# EAGLE design timer rtc io (EAGLE 9.6.2)
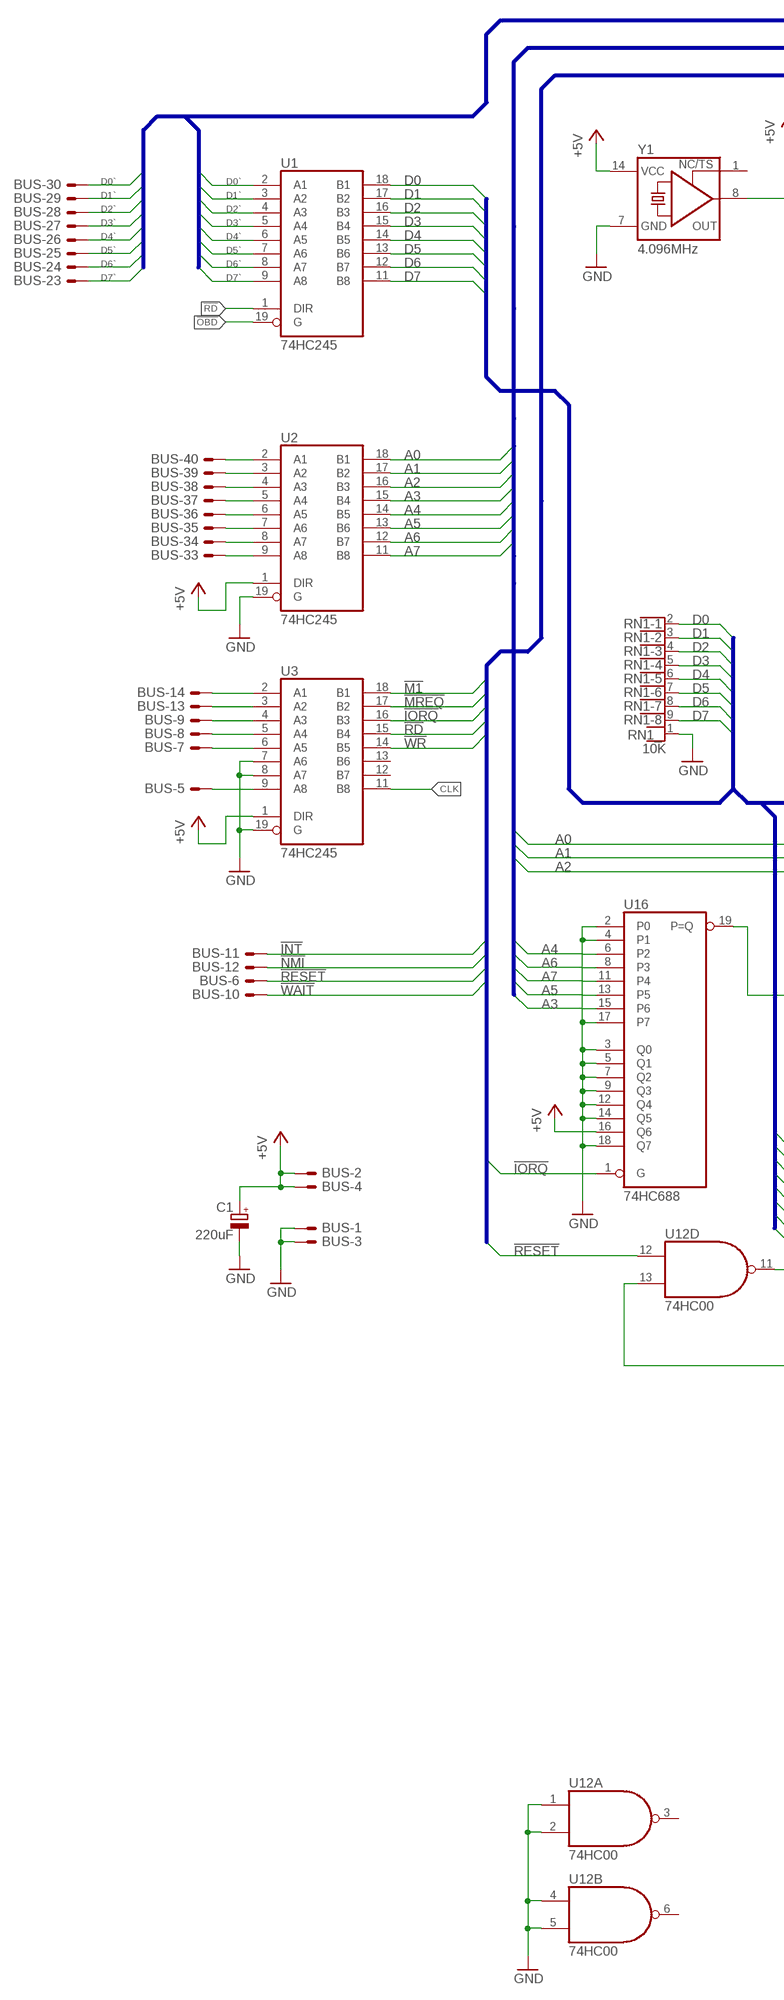
[diagram p0: schematic, sheet 1, part 1 of 2]
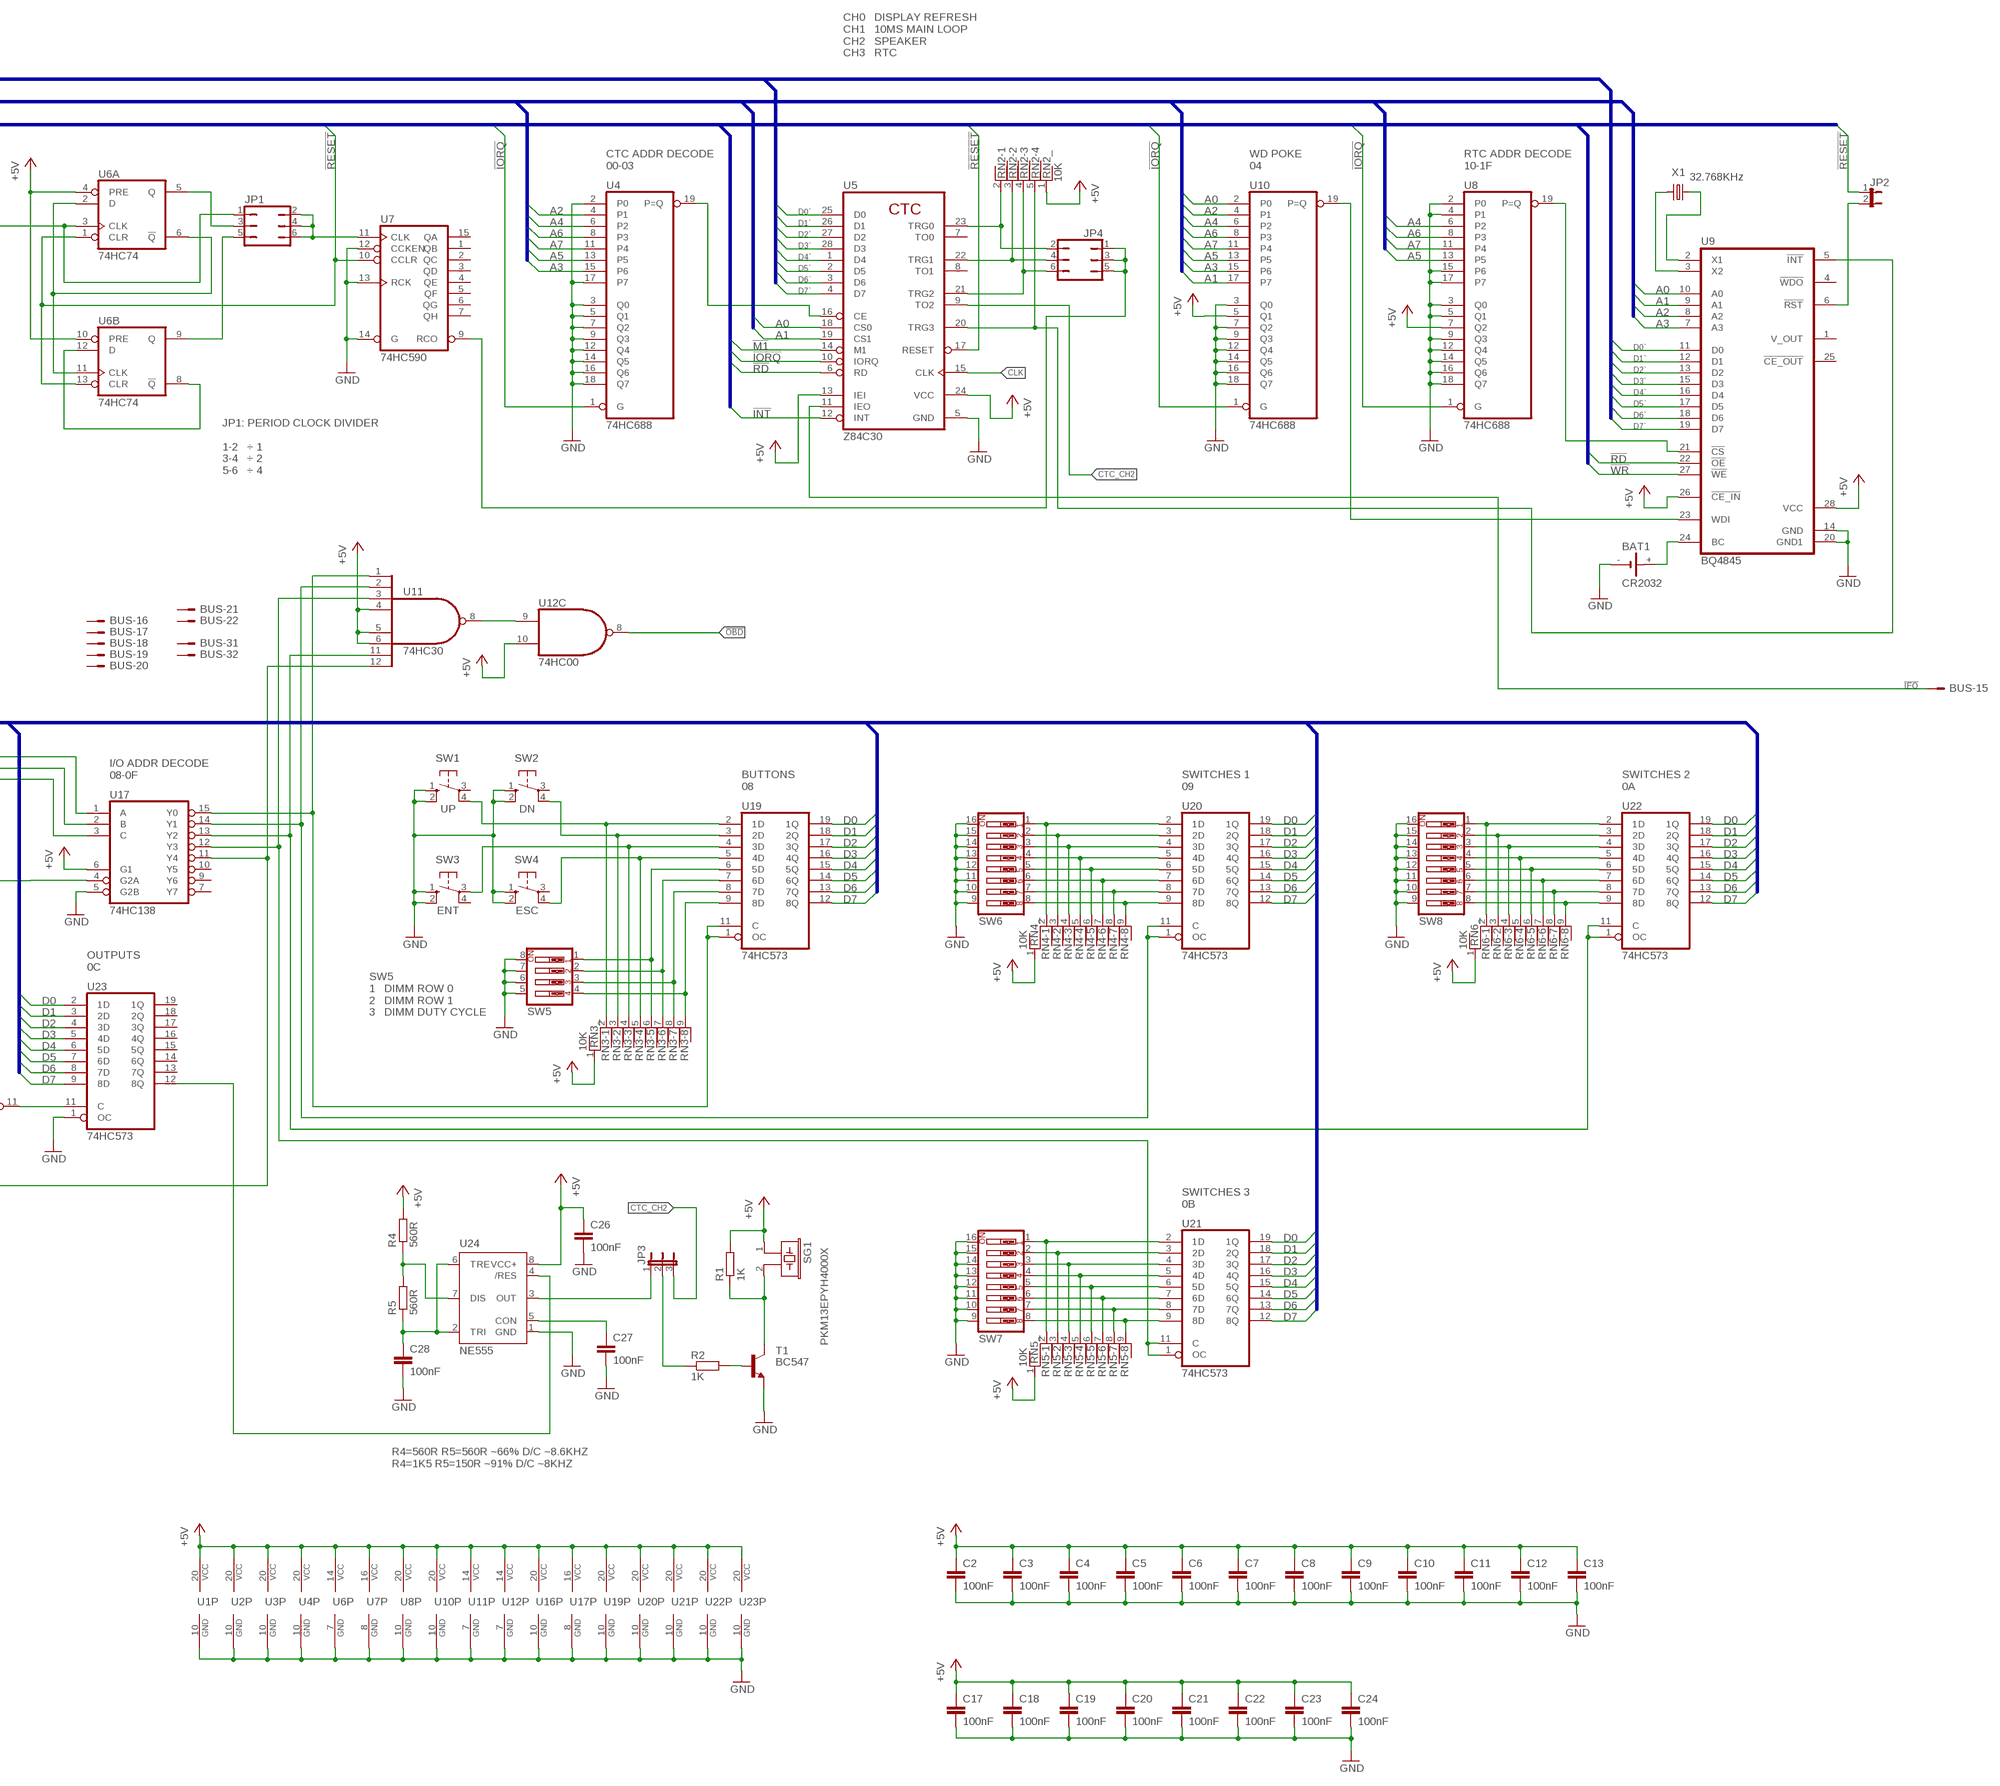
[diagram p1: schematic, sheet 1, part 2 of 2]

## Parts
BAT1  CR2032  CR2032-SMD  [CR2032-SMD]
BUS  HDR40  [HDR40]
C1  220uF  CPOL-EUE3.5-8  [E3,5-8]
C2  100nF  C-EU050-025X075  [C050-025X075]
C3  100nF  C-EU050-025X075  [C050-025X075]
C4  100nF  C-EU050-025X075  [C050-025X075]
C5  100nF  C-EU050-025X075  [C050-025X075]
C6  100nF  C-EU050-025X075  [C050-025X075]
C7  100nF  C-EU050-025X075  [C050-025X075]
C8  100nF  C-EU050-025X075  [C050-025X075]
C9  100nF  C-EU050-025X075  [C050-025X075]
C10  100nF  C-EU050-025X075  [C050-025X075]
C11  100nF  C-EU050-025X075  [C050-025X075]
C12  100nF  C-EU050-025X075  [C050-025X075]
C13  100nF  C-EU050-025X075  [C050-025X075]
C17  100nF  C-EU050-025X075  [C050-025X075]
C18  100nF  C-EU050-025X075  [C050-025X075]
C19  100nF  C-EU050-025X075  [C050-025X075]
C20  100nF  C-EU050-025X075  [C050-025X075]
C21  100nF  C-EU050-025X075  [C050-025X075]
C22  100nF  C-EU050-025X075  [C050-025X075]
C23  100nF  C-EU050-025X075  [C050-025X075]
C24  100nF  C-EU050-025X075  [C050-025X075]
C26  100nF  C-EU050-025X075  [C050-025X075]
C27  100nF  C-EU050-025X075  [C050-025X075]
C28  100nF  C-EU050-025X075  [C050-025X075]
JP1  JP3Q  [JP3Q]
JP2  JP1E  [JP1]
JP3  JP2E  [JP2]
JP4  JP3Q  [JP3Q]
R1  1K  R-EU_0207/10  [0207/10]
R2  1K  R-EU_0207/10  [0207/10]
R4  560R  R-EU_0207/10  [0207/10]
R5  560R  R-EU_0207/10  [0207/10]
RN1  10K  RNX8  [RN-9]
RN2  10K  RNX4  [RN-5]
RN3  10K  RNX8  [RN-9]
RN4  10K  RNX8  [RN-9]
RN5  10K  RNX8  [RN-9]
RN6  10K  RNX8  [RN-9]
SG1  PKM13EPYH4000X  [PKM13EPYH400X]
SW1  10-XX  [B3F-10XX]
SW2  10-XX  [B3F-10XX]
SW3  10-XX  [B3F-10XX]
SW4  10-XX  [B3F-10XX]
SW5  SW_DIP-4  [EDG-04]
SW6  SW_DIP-8  [EDG-08]
SW7  SW_DIP-8  [EDG-08]
SW8  SW_DIP-8  [EDG-08]
T1  BC547  [TO92]
U1  74HC245  74LS245N  [DIL20]
U2  74HC245  74LS245N  [DIL20]
U3  74HC245  74LS245N  [DIL20]
U4  74HC688  74LS688N  [DIL20]
U5  Z84C30  Z80CTC  [DIL28]
U6  74HC74  74LS74N  [DIL14]
U7  74HC590  74LS590N  [DIL16]
U8  74HC688  74LS688N  [DIL20]
U9  BQ4845  BQ4845P  [DIL28-6]
U10  74HC688  74LS688N  [DIL20]
U11  74HC30  74LS30N  [DIL14]
U12  74HC00  74LS00N  [DIL14]
U16  74HC688  74LS688N  [DIL20]
U17  74HC138  74LS138N  [DIL16]
U19  74HC573  74HC573N  [DIL20]
U20  74HC573  74HC573N  [DIL20]
U21  74HC573  74HC573N  [DIL20]
U22  74HC573  74HC573N  [DIL20]
U23  74HC573  74HC573N  [DIL20]
U24  NE555  [DIL-08]
X1  32.768KHz  CRYSTALTC38H  [TC38H]
Y1  4.096MHz  XO-14  [DIL14S]

## Nets
!IEO!: BUS.15 U5.11(IEO)
!INT!: BUS.11 U5.12(INT)
!IORQ!: U3.16(B3) U4.1(G) U5.10(IORQ) U8.1(G) U10.1(G) U16.1(G)
!M1!: U3.18(B1) U5.14(M1)
!MREQ!: U3.17(B2)
!NMI!: BUS.12
!OBD!: U1.19(G) U12.8(C:O)
!RD!: U1.1(DIR) U3.15(B4) U5.6(RD) U9.22(!OE!)
!RESET!: BUS.6 JP2.1 U5.17(RESET) U6.1(A:CLR) U6.13(B:CLR) U7.10(CCLR) U12.12(D:I0)
!WAIT!: BUS.10
!WR!: U3.14(B5) U9.27(!WE!)
+5V: BUS.2 BUS.4 C1.+ C2.1 C3.1 C4.1 C5.1 C6.1 C7.1 C8.1 C9.1 C10.1 C11.1 C12.1 C13.1 C17.1 C18.1 C19.1 C20.1 C21.1 C22.1 C23.1 C24.1 C26.1 R1.2 R4.2 RN2.1 RN3.1 RN4.1 RN5.1 RN6.1 SG1.1 U1.20(VCC) U2.1(DIR) U2.20(VCC) U3.1(DIR) U3.20(VCC) U4.20(VCC) U5.13(IEI) U5.24(VCC) U6.4(A:PRE) U6.10(B:PRE) U6.14(P:VCC) U7.16(VCC) U8.7(Q2) U8.20(VCC) U9.26(!CE_IN!) U9.28(VCC) U10.5(Q1) U10.20(VCC) U11.4(I3) U11.5(I4) U11.6(I5) U11.14(VCC) U12.10(C:I1) U12.14(P:VCC) U16.16(Q6) U16.20(VCC) U17.6(G1) U17.16(VCC) U19.20(VCC) U20.20(VCC) U21.20(VCC) U22.20(VCC) U23.20(VCC) U24.8(VCC+) Y1.14(VCC)
A0: U2.18(B1) U5.18(CS0) U9.10(A0) U10.2(P0) U17.1(A)
A1: U2.17(B2) U5.19(CS1) U9.9(A1) U10.17(P7) U17.2(B)
A2: U2.16(B3) U4.4(P1) U9.8(A2) U10.4(P1) U17.3(C)
A3: U2.15(B4) U4.15(P6) U9.7(A3) U10.15(P6) U16.15(P6)
A4: U2.14(B5) U4.6(P2) U8.6(P2) U10.6(P2) U16.6(P2)
A5: U2.13(B6) U4.13(P5) U8.13(P5) U10.13(P5) U16.13(P5)
A6: U2.12(B7) U4.8(P3) U8.8(P3) U10.8(P3) U16.8(P3)
A7: U2.11(B8) U4.11(P4) U8.11(P4) U10.11(P4) U16.11(P4)
CLK: U3.11(B8) U5.15(CLK)
CTC_CH2: JP3.3 U5.9(TO2)
D0: RN1.2 U1.18(B1) U19.19(1Q) U20.19(1Q) U21.19(1Q) U22.19(1Q) U23.2(1D)
D0`: BUS.30 U1.2(A1) U5.25(D0) U9.11(D0)
D1: RN1.3 U1.17(B2) U19.18(2Q) U20.18(2Q) U21.18(2Q) U22.18(2Q) U23.3(2D)
D1`: BUS.29 U1.3(A2) U5.26(D1) U9.12(D1)
D2: RN1.4 U1.16(B3) U19.17(3Q) U20.17(3Q) U21.17(3Q) U22.17(3Q) U23.4(3D)
D2`: BUS.28 U1.4(A3) U5.27(D2) U9.13(D2)
D3: RN1.5 U1.15(B4) U19.16(4Q) U20.16(4Q) U21.16(4Q) U22.16(4Q) U23.5(4D)
D3`: BUS.27 U1.5(A4) U5.28(D3) U9.15(D3)
D4: RN1.6 U1.14(B5) U19.15(5Q) U20.15(5Q) U21.15(5Q) U22.15(5Q) U23.6(5D)
D4`: BUS.26 U1.6(A5) U5.1(D4) U9.16(D4)
D5: RN1.7 U1.13(B6) U19.14(6Q) U20.14(6Q) U21.14(6Q) U22.14(6Q) U23.7(6D)
D5`: BUS.25 U1.7(A6) U5.2(D5) U9.17(D5)
D6: RN1.8 U1.12(B7) U19.13(7Q) U20.13(7Q) U21.13(7Q) U22.13(7Q) U23.8(7D)
D6`: BUS.24 U1.8(A7) U5.3(D6) U9.18(D6)
D7: RN1.9 U1.11(B8) U19.12(8Q) U20.12(8Q) U21.12(8Q) U22.12(8Q) U23.9(8D)
D7`: BUS.23 U1.9(A8) U5.4(D7) U9.19(D7)
GND: BAT1.- BUS.1 BUS.3 C1.- C2.2 C3.2 C4.2 C5.2 C6.2 C7.2 C8.2 C9.2 C10.2 C11.2 C12.2 C13.2 C17.2 C18.2 C19.2 C20.2 C21.2 C22.2 C23.2 C24.2 C26.2 C27.2 C28.2 RN1.1 SW1.1(S) SW1.2(S1) SW2.1(S) SW2.2(S1) SW3.1(S) SW3.2(S1) SW4.1(S) SW4.2(S1) SW5.5 SW5.6 SW5.7 SW5.8 SW6.9 SW6.10 SW6.11 SW6.12 SW6.13 SW6.14 SW6.15 SW6.16 SW7.9 SW7.10 SW7.11 SW7.12 SW7.13 SW7.14 SW7.15 SW7.16 SW8.9 SW8.10 SW8.11 SW8.12 SW8.13 SW8.14 SW8.15 SW8.16 T1.1(E) U1.10(GND) U2.10(GND) U2.19(G) U3.7(A6) U3.8(A7) U3.10(GND) U3.19(G) U4.2(P0) U4.3(Q0) U4.5(Q1) U4.7(Q2) U4.9(Q3) U4.10(GND) U4.12(Q4) U4.14(Q5) U4.16(Q6) U4.17(P7) U4.18(Q7) U5.5(GND) U6.7(P:GND) U7.8(GND) U7.12(CCKEN) U7.13(RCK) U7.14(G) U8.2(P0) U8.3(Q0) U8.4(P1) U8.5(Q1) U8.9(Q3) U8.10(GND) U8.12(Q4) U8.14(Q5) U8.15(P6) U8.16(Q6) U8.17(P7) U8.18(Q7) U9.14(GND) U9.20(GND1) U10.3(Q0) U10.7(Q2) U10.9(Q3) U10.10(GND) U10.12(Q4) U10.14(Q5) U10.16(Q6) U10.18(Q7) U11.7(GND) U12.1(A:I0) U12.2(A:I1) U12.4(B:I0) U12.5(B:I1) U12.7(P:GND) U16.2(P0) U16.3(Q0) U16.4(P1) U16.5(Q1) U16.7(Q2) U16.9(Q3) U16.10(GND) U16.12(Q4) U16.14(Q5) U16.17(P7) U16.18(Q7) U17.5(G2B) U17.8(GND) U19.10(GND) U20.10(GND) U21.10(GND) U22.10(GND) U23.1(OC) U23.10(GND) U24.1(GND) Y1.7(GND)
N$1: U6.2(A:D) U6.6(A:!Q) U6.11(B:CLK)
N$2: U9.2(X1) X1.1
N$3: U9.23(WDI) U10.19(P=Q)
N$4: U9.3(X2) X1.2
N$5: U11.8(O) U12.9(C:I0)
N$6: BAT1.+ U9.24(BC)
N$7: U8.19(P=Q) U9.21(!CS!)
N$8: U12.11(D:O) U23.11(C)
N$9: JP1.3 U6.5(A:Q)
N$10: U16.19(P=Q) U17.4(G2A)
N$11: JP4.4 RN2.3 U5.22(TRG1)
N$12: RN4.2 SW6.1 U20.2(1D)
N$13: RN4.3 SW6.2 U20.3(2D)
N$14: RN4.4 SW6.3 U20.4(3D)
N$15: RN4.5 SW6.4 U20.5(4D)
N$16: RN4.6 SW6.5 U20.6(5D)
N$17: RN4.7 SW6.6 U20.7(6D)
N$18: RN4.8 SW6.7 U20.8(7D)
N$19: RN4.9 SW6.8 U20.9(8D)
N$20: RN5.2 SW7.1 U21.2(1D)
N$21: RN5.3 SW7.2 U21.3(2D)
N$22: RN5.4 SW7.3 U21.4(3D)
N$23: RN5.5 SW7.4 U21.5(4D)
N$24: RN5.6 SW7.5 U21.6(5D)
N$25: RN5.7 SW7.6 U21.7(6D)
N$26: RN5.8 SW7.7 U21.8(7D)
N$27: RN5.9 SW7.8 U21.9(8D)
N$28: RN6.2 SW8.1 U22.2(1D)
N$29: RN6.3 SW8.2 U22.3(2D)
N$30: RN6.4 SW8.3 U22.4(3D)
N$31: RN6.5 SW8.4 U22.5(4D)
N$32: RN6.6 SW8.5 U22.6(5D)
N$33: RN6.7 SW8.6 U22.7(6D)
N$34: RN6.8 SW8.7 U22.8(7D)
N$35: RN6.9 SW8.8 U22.9(8D)
N$36: JP1.5 U6.9(B:Q)
N$37: RN3.2 SW1.4(P1) U19.2(1D)
N$38: RN3.3 SW2.4(P1) U19.3(2D)
N$39: RN3.4 SW3.3(P) U19.4(3D)
N$40: RN3.5 SW4.4(P1) U19.5(4D)
N$41: RN3.6 SW5.1 U19.6(5D)
N$42: RN3.7 SW5.2 U19.7(6D)
N$43: RN3.8 SW5.3 U19.8(7D)
N$44: RN3.9 SW5.4 U19.9(8D)
N$45: U11.1(I0) U17.15(Y0) U19.1(OC) U19.11(C)
N$46: U11.2(I1) U17.14(Y1) U20.1(OC) U20.11(C)
N$47: U11.11(I6) U17.13(Y2) U22.1(OC) U22.11(C)
N$50: JP4.2 RN2.2 U5.23(TRG0)
N$52: RN2.5 U5.20(TRG3) U9.5(!INT!)
N$53: JP2.2 U9.6(!RST!)
N$54: U11.12(I7) U12.13(D:I1) U17.11(Y4)
N$55: C27.1 U24.5(CON)
N$56: U23.12(8Q) U24.4(/RES)
N$57: JP1.1 U6.3(A:CLK) Y1.8(OUT)
N$58: U6.8(B:!Q) U6.12(B:D)
N$59: JP4.1 JP4.3 JP4.5 U7.9(RCO)
N$60: R1.1 SG1.2 T1.3(C)
N$61: JP3.1 U24.3(OUT)
N$62: JP3.2 R2.1
N$63: JP1.2 JP1.4 JP1.6 U7.11(CLK)
N$64: U4.19(P=Q) U5.16(CE)
N$72: BUS.33 U2.9(A8)
N$73: BUS.34 U2.8(A7)
N$74: BUS.35 U2.7(A6)
N$75: BUS.36 U2.6(A5)
N$76: BUS.37 U2.5(A4)
N$77: BUS.38 U2.4(A3)
N$78: BUS.39 U2.3(A2)
N$79: BUS.40 U2.2(A1)
N$80: BUS.14 U3.2(A1)
N$81: BUS.13 U3.3(A2)
N$82: BUS.9 U3.4(A3)
N$83: BUS.8 U3.5(A4)
N$84: BUS.7 U3.6(A5)
N$85: BUS.5 U3.9(A8)
N$86: R2.2 T1.2(B)
N$88: R4.1 R5.2 U24.7(DIS)
N$89: C28.1 R5.1 U24.2(TRI) U24.6(TRE)
N$90: U11.3(I2) U17.12(Y3) U21.1(OC) U21.11(C)
N$92: JP4.6 RN2.4 U5.21(TRG2)
Unconnected: BUS.16 BUS.17 BUS.18 BUS.19 BUS.20 BUS.21 BUS.22 BUS.31 BUS.32 SW1.3(P) SW2.3(P) SW3.4(P1) SW4.3(P) U3.12(B7) U3.13(B6) U5.7(TO0) U5.8(TO1) U7.1(QB) U7.2(QC) U7.3(QD) U7.4(QE) U7.5(QF) U7.6(QG) U7.7(QH) U7.15(QA) U9.1(V_OUT) U9.4(!WDO!) U9.25(!CE_OUT!) U12.3(A:O) U12.6(B:O) U17.7(Y7) U17.9(Y6) U17.10(Y5) U23.13(7Q) U23.14(6Q) U23.15(5Q) U23.16(4Q) U23.17(3Q) U23.18(2Q) U23.19(1Q) Y1.1(TS)

## Buses
Z80DATA:D[0..7]
Z80ADDRESS:A[0..15]
Z80CONTROL:!BUSAK!,!BUSRQ!,!HALT!,!INT!,!IORQ!,!M1!,!MREQ!,!NMI!,!RD!,!RESET!,!RFSH!,!WAIT!,!WR!
Z80_DATA_UB:D0`,D1`,D2`,D3`,D4`,D5`,D6`,D7`

## Notes on the sheet
- CH0   DISPLAY REFRESH
  CH1   10MS MAIN LOOP
  CH2   SPEAKER
  CH3   RTC
- CTC ADDR DECODE
  00-03
- WD POKE
  04
- RTC ADDR DECODE
  10-1F
- JP1: PERIOD CLOCK DIVIDER
  
  1-2   ÷ 1
  3-4   ÷ 2
  5-6   ÷ 4
- I/O ADDR DECODE
  08-0F
- BUTTONS
  08
- SWITCHES 1
  09
- SWITCHES 2
  0A
- UP | DN
- ENT | ESC
- OUTPUTS
  0C
- SW5
  1   DIMM ROW 0
  2   DIMM ROW 1
  3   DIMM DUTY CYCLE
- SWITCHES 3
  0B
- R4=560R R5=560R ~66% D/C ~8.6KHZ
  R4=1K5 R5=150R ~91% D/C ~8KHZ

## Library data of the parts
BAT1 = Z80 clock:CR2032-SMD
BUS = Z80 clock:HDR40
C1 = rcl:CPOL-EU: POLARIZED CAPACITOR, European symbol; SPICEPREFIX: C
C2-C13 C17-C24 C26-C28 = rcl:C-EU: CAPACITOR, European symbol; SPICEPREFIX: C
JP1 JP4 = Z80 clock:JP3Q: JUMPER
JP2 = jumper:JP1E: JUMPER
JP3 = jumper:JP2E: JUMPER
R1 R2 R4 R5 = rcl:R-EU_: RESISTOR, European symbol; SPICEPREFIX: R
RN1 RN3-RN6 = resistor-net:RNX8: RESISTOR NETWORK; OC_FARNELL: unknown; OC_NEWARK: unknown
RN2 = resistor-net:RNX4: RESISTOR NETWORK; OC_FARNELL: unknown; OC_NEWARK: unknown
SG1 = Z80 clock:PKM13EPYH4000X
SW1-SW4 = switch-omron:10-XX: OMRON SWITCH; MPN: B3F-1000; OC_FARNELL: 176432; OC_NEWARK: 36M3542
SW5 = special:SW_DIP-4: DIP SWITCH
SW6-SW8 = special:SW_DIP-8: DIP SWITCH
T1 = transistor:BC547: NPN TRANSISTOR
U1-U3 = 74xx-us:74*245: Octal BUS TRANSCEIVER, 3-state
U4 U8 U10 U16 = 74xx-us:74*688: 8-bit MAGNITUDE/IDENTITY COMPARATOR, totem pole
U5 = zilog:Z80CTC: Z80 FAMILY DEVICE
U6 = 74xx-us:74*74: Dual D type positive edge triggered FLIP FLOP, preset and clear
U7 = 74xx-us:74*590: 8-bit binary COUNTER, output register
U9 = Z80 clock:BQ4845
U11 = 74xx-us:74*30: 8-input NAND gate
U12 = 74xx-us:74*00: Quad 2-input NAND gate
U17 = 74xx-us:74*138: 3-line to 8-line DECODER/DEMULTIPLEXER
U19-U23 = 74xx-us:74*573: 8-bit D latch BUS DRIVER
U24 = st-microelectronics:NE555: General purpose bipolar Timer; MF: Arrow Electronics; MPN: NE555N; OC_FARNELL: 1467742; OC_NEWARK: 89K1486
X1 = crystal:CRYSTAL: CRYSTAL; OC_FARNELL: unknown; OC_NEWARK: unknown
Y1 = crystal:XO-: CRYSTAL; OC_FARNELL: unknown; OC_NEWARK: unknown

## Board
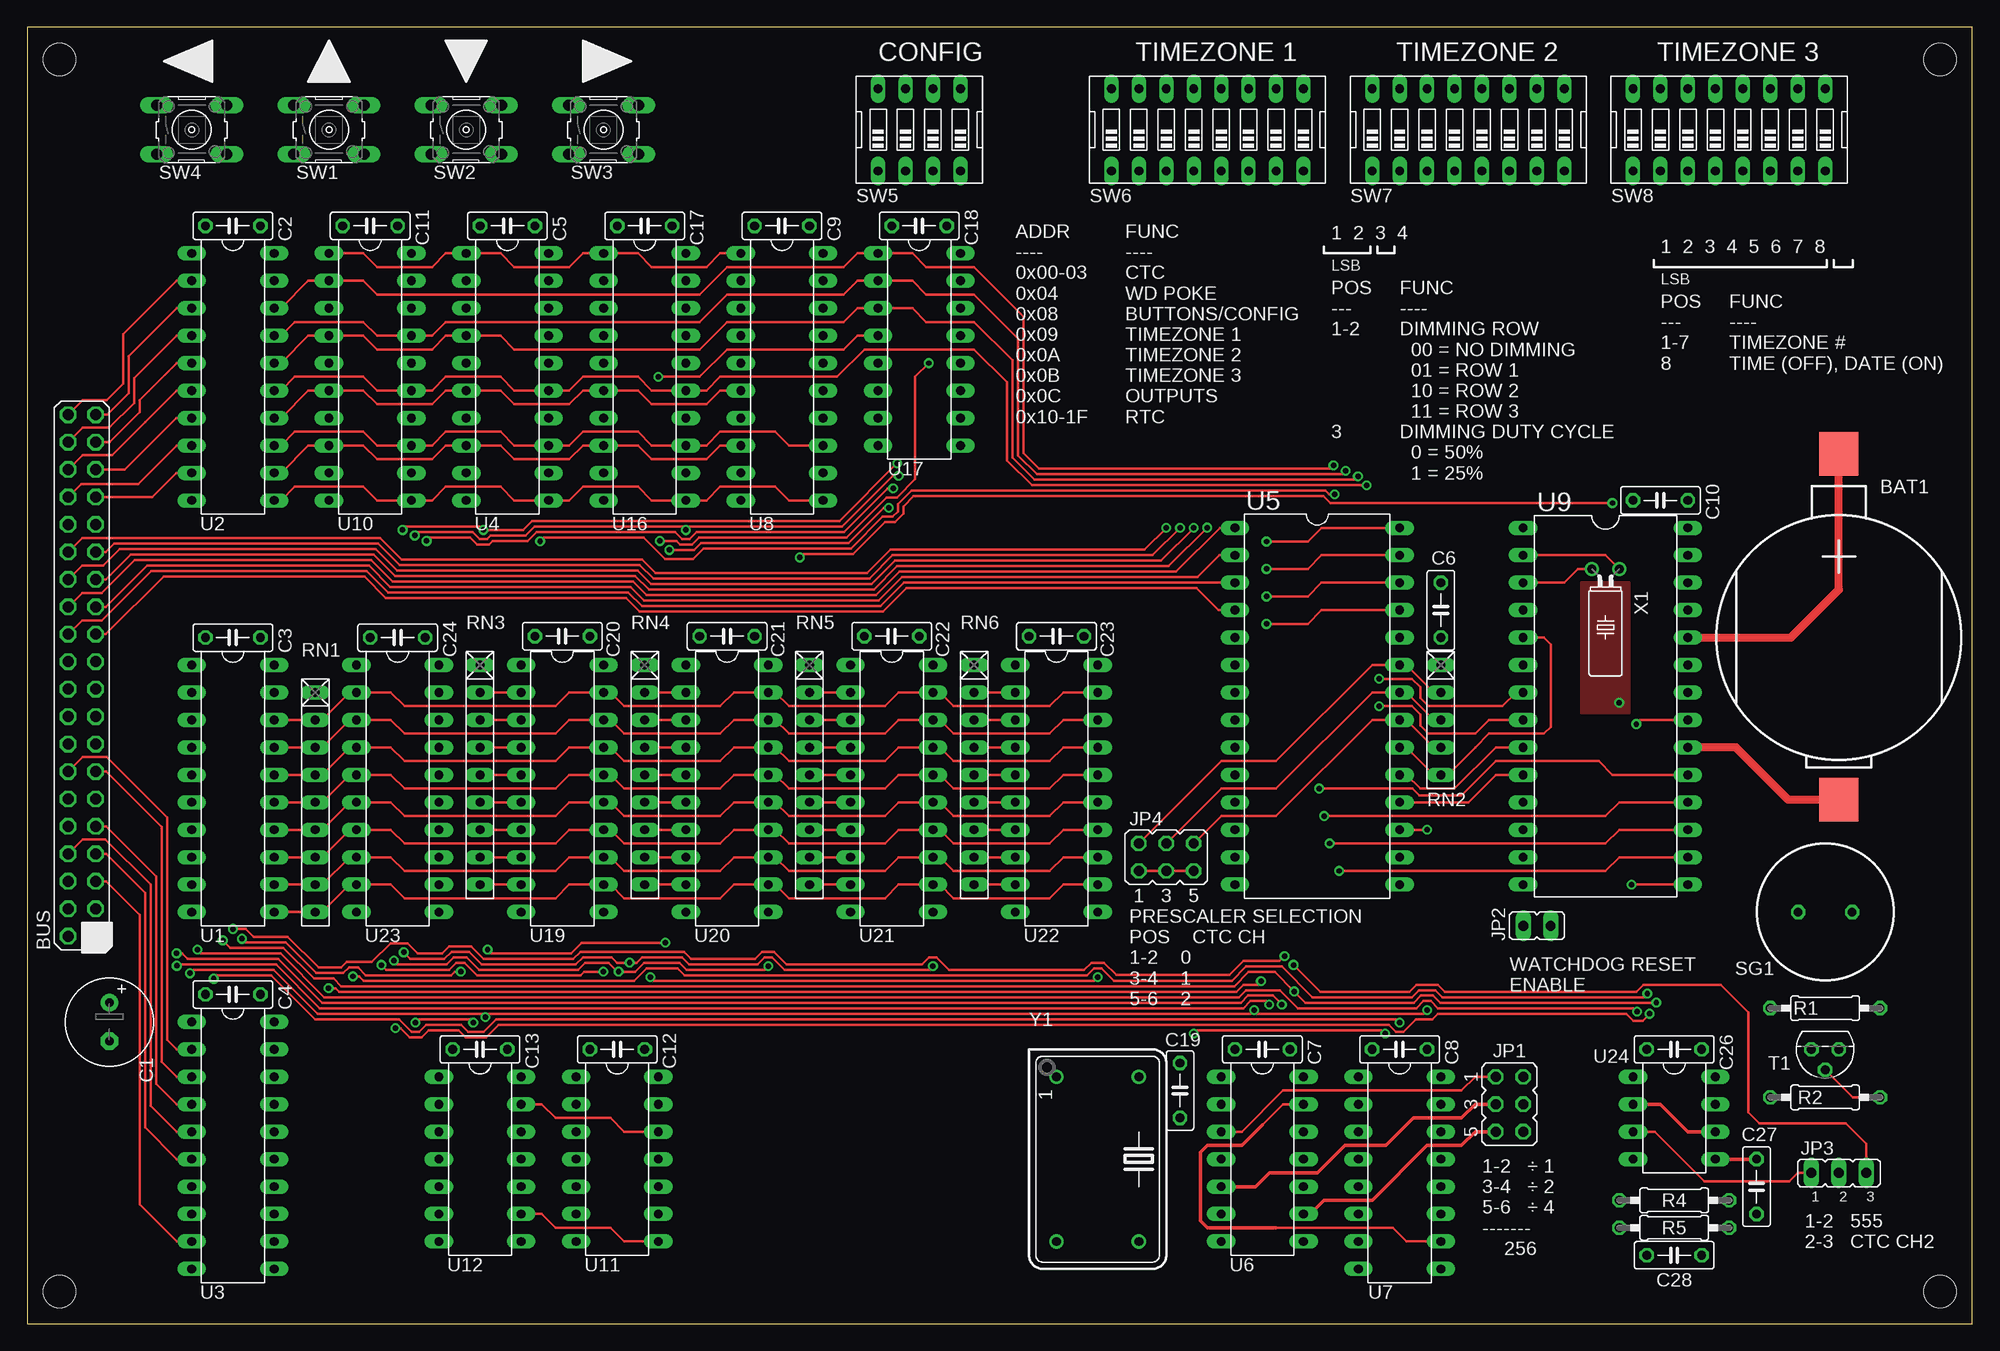
[diagram p2: board, top side]
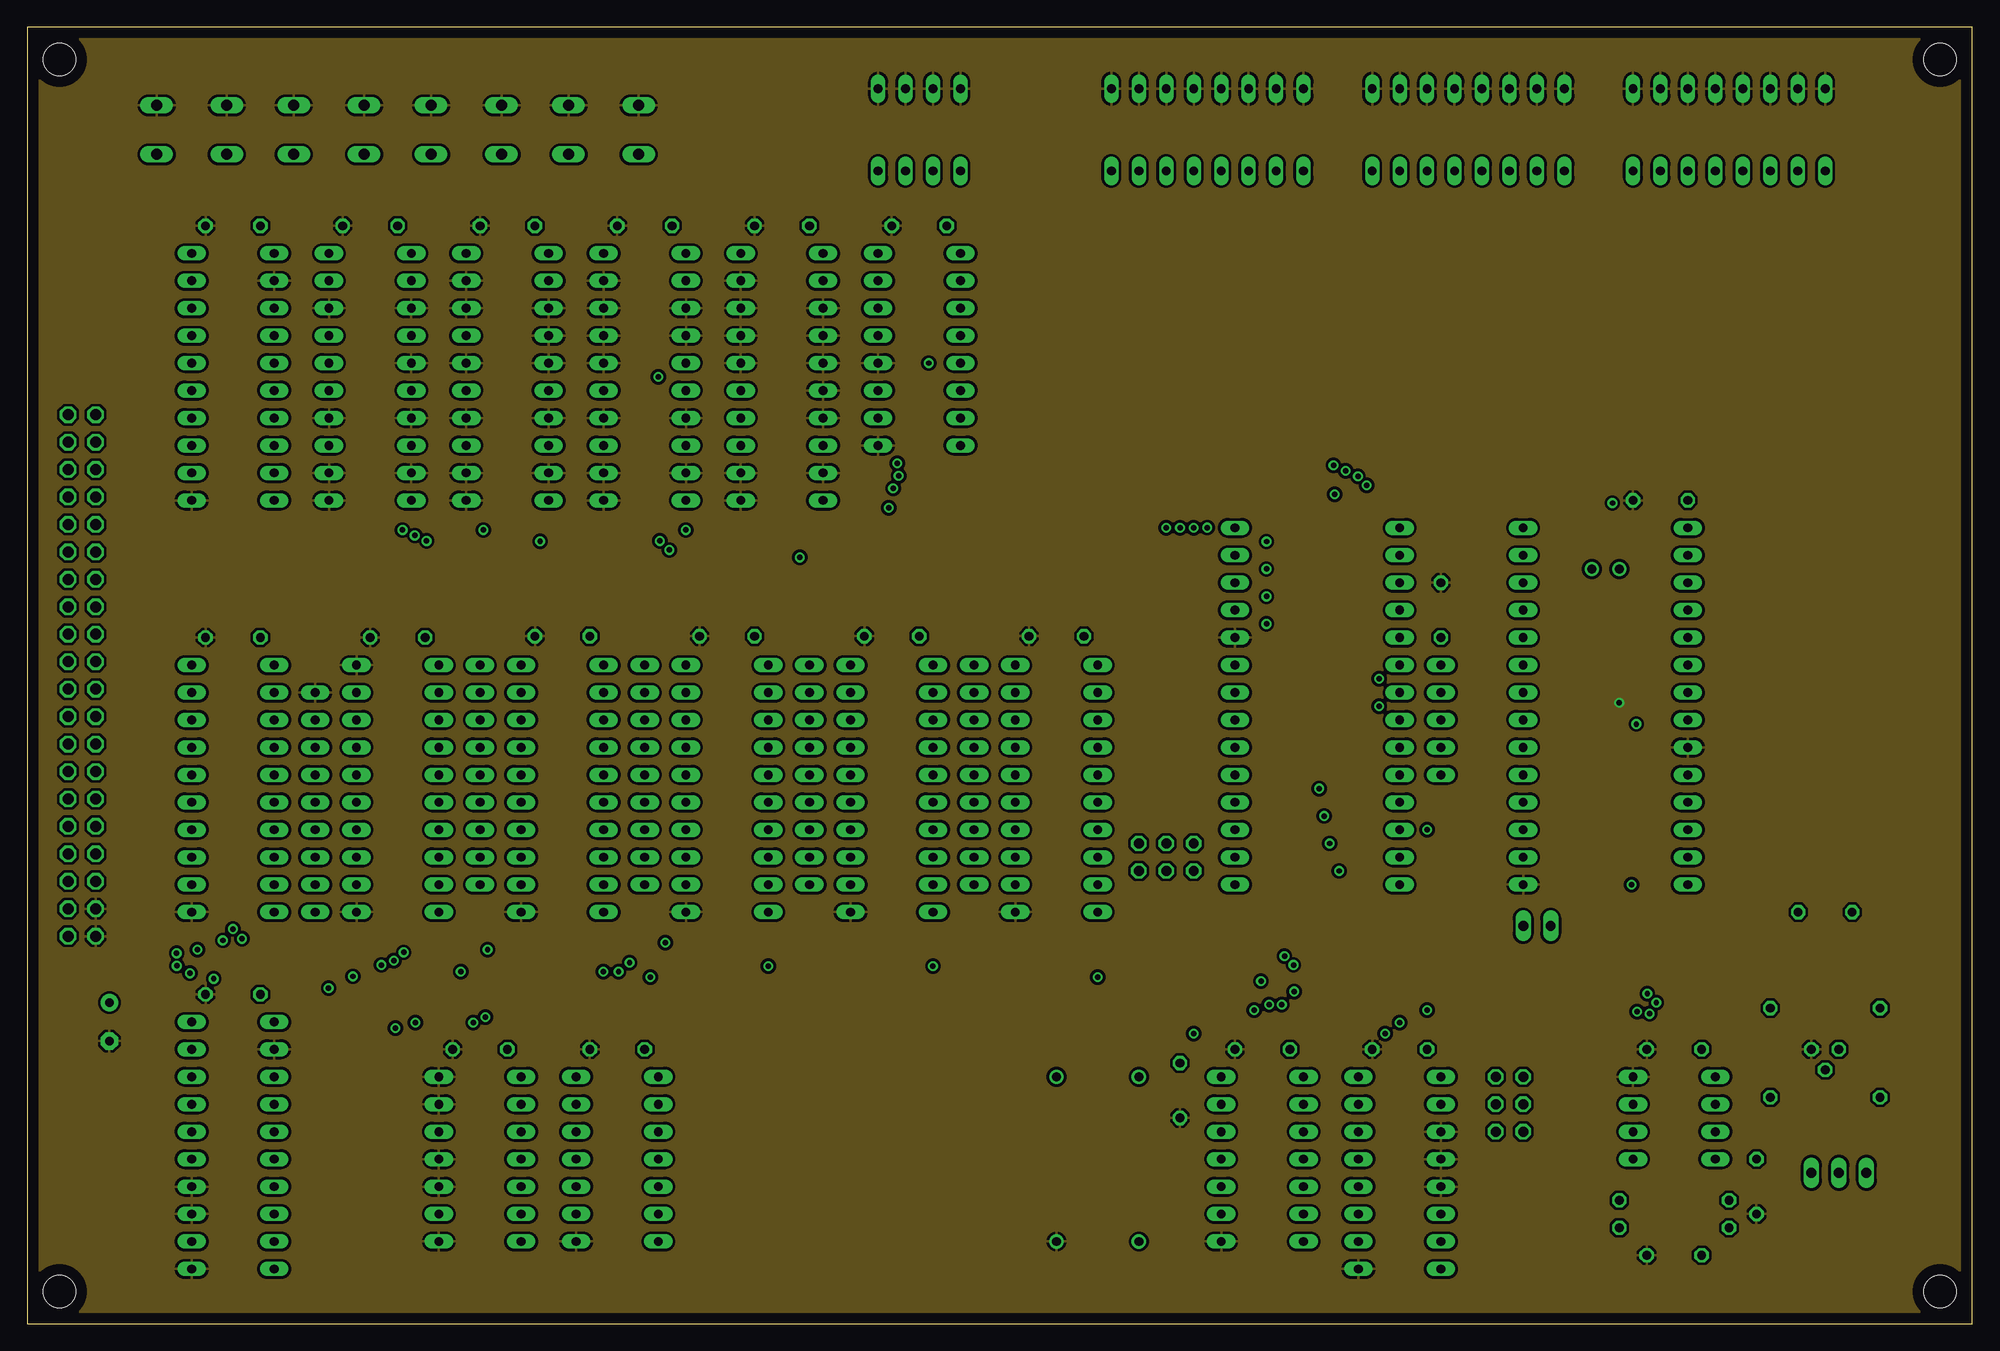
[diagram p3: board, inner layer Route2]
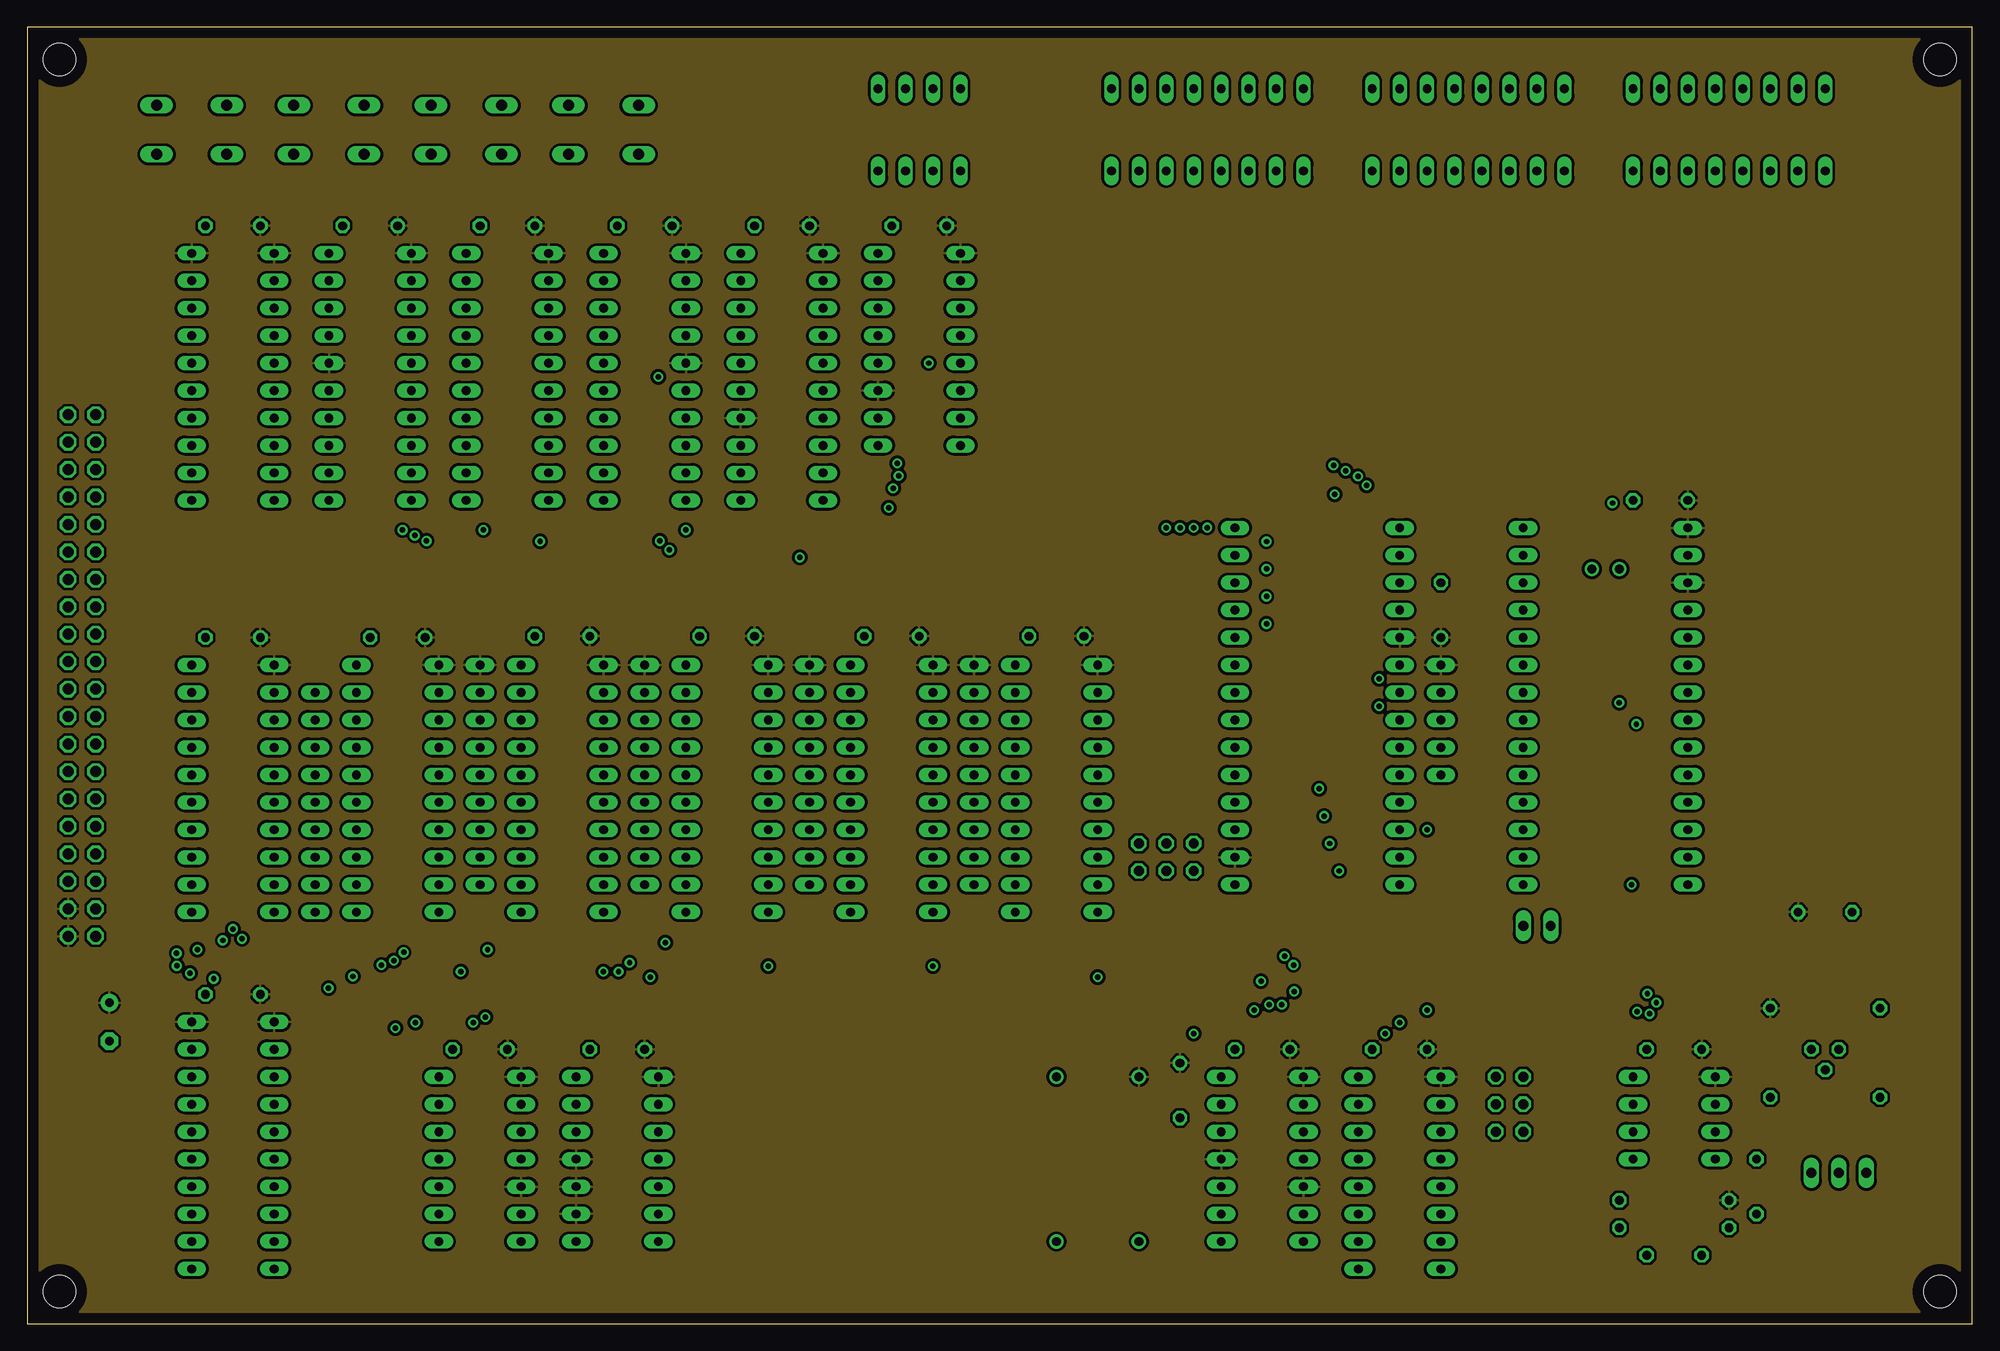
[diagram p4: board, inner layer Route3]
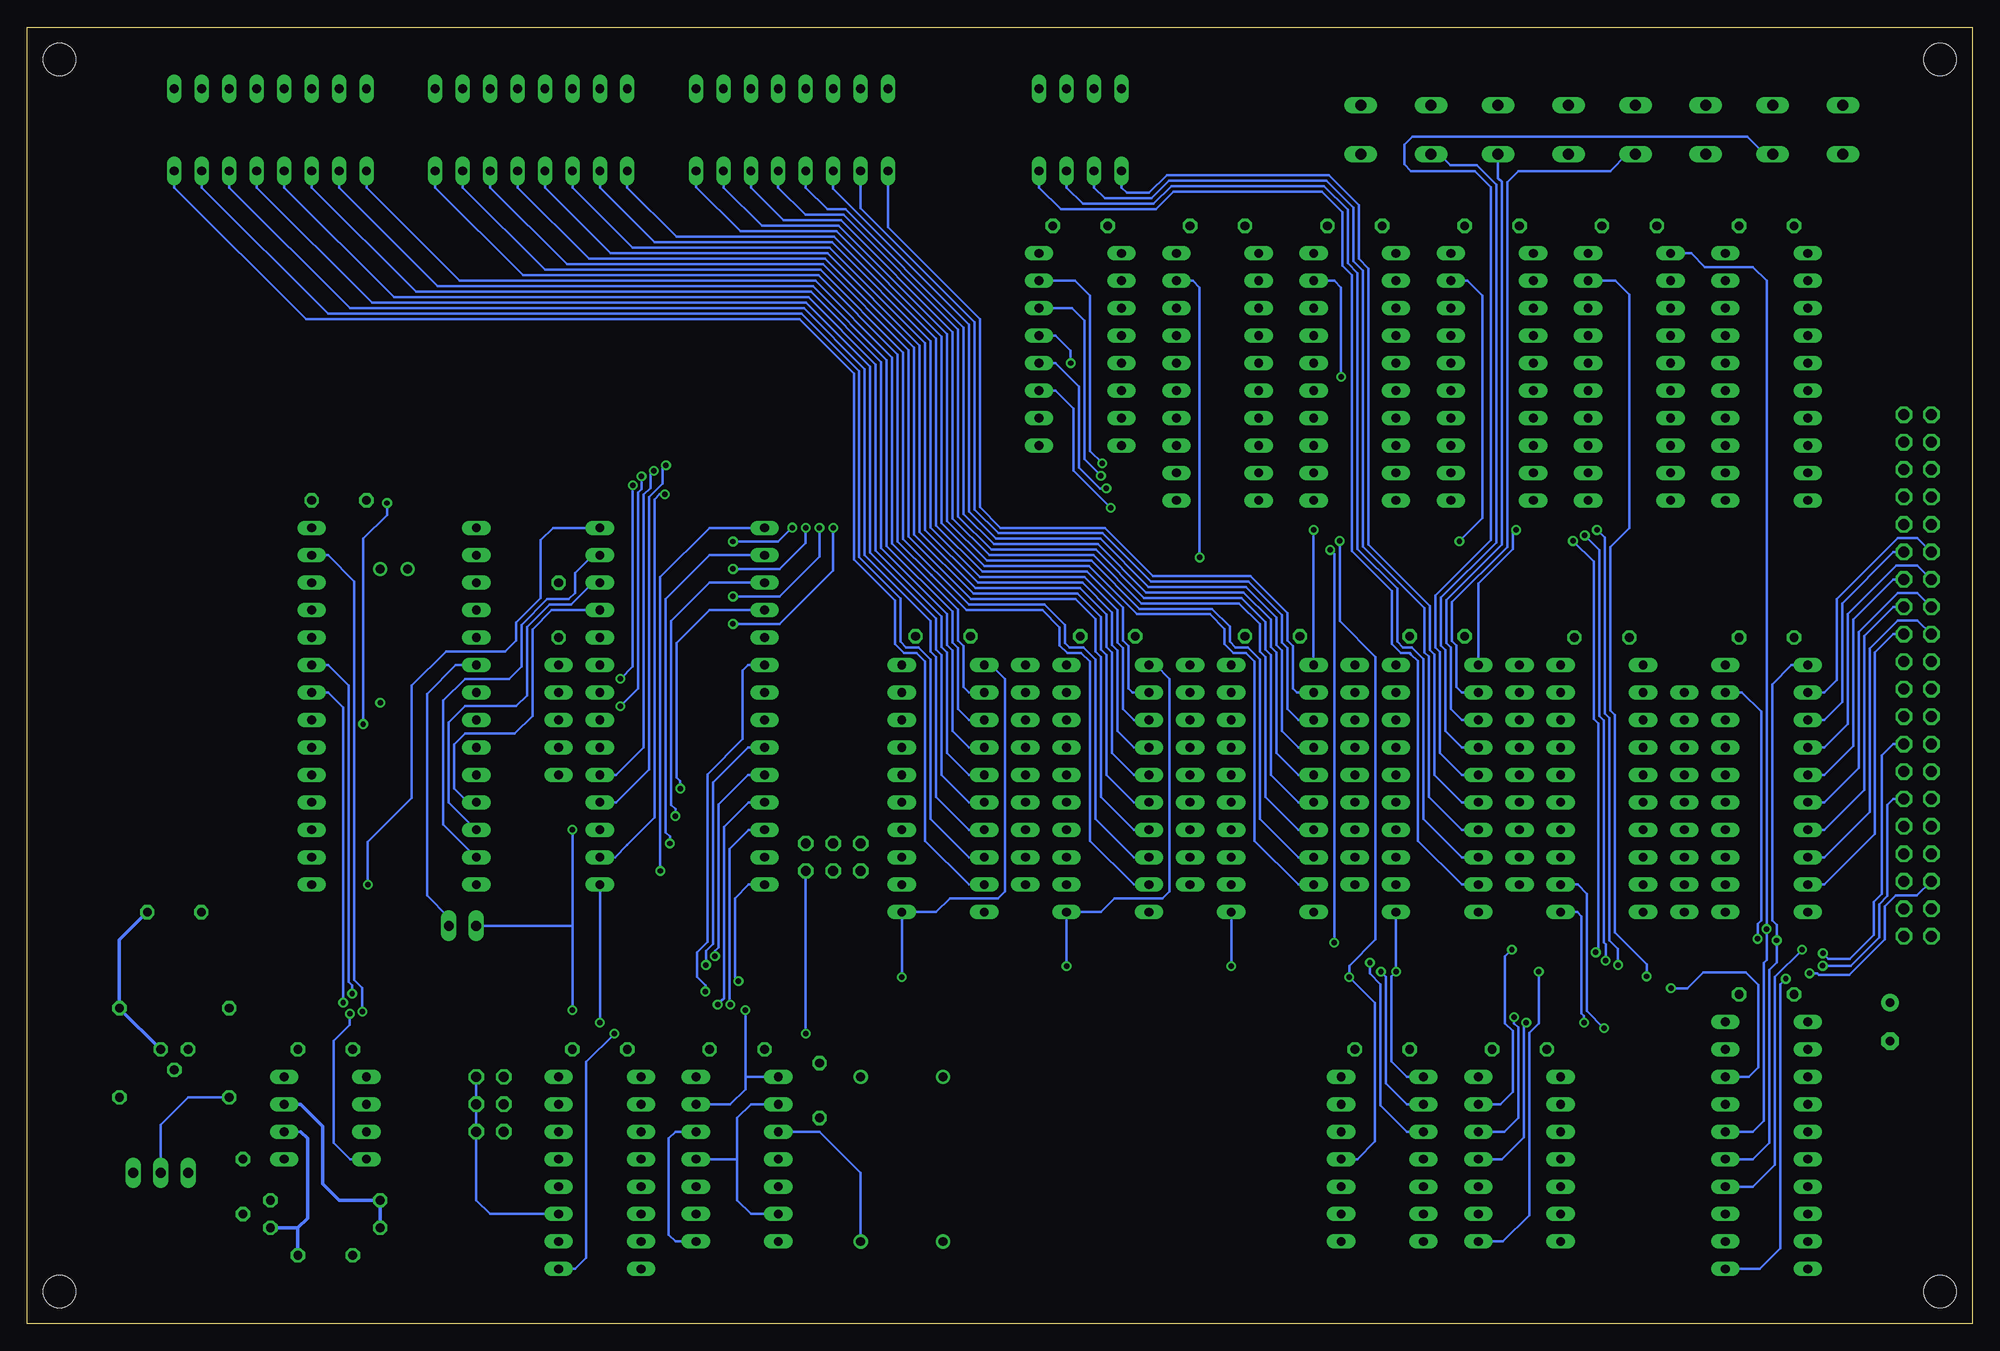
[diagram p5: board, bottom side, seen from below]

Size 180 x 120 mm. Coordinates in mm from the lower left corner, seen from the top.
Outline: 0,0 180,0 180,120 0,120 0,0
Copper layers (1*2*3*16): Top 0.035mm / dielectric 1.5mm / Route2 0.035mm / dielectric 0.15mm / Route3 0.035mm / dielectric 0.2mm / Bottom 0.035mm
Design rules "default *": minimum track width 10mil, minimum drill 0.5mm, track to track 10mil, track to pad 10mil, pad to pad 10mil, via to via 10mil, smd to smd 10mil, copper to edge 40mil, drill to drill 6mil, minimum pad ring 10mil, minimum via ring 8mil, stop-mask expansion 4mil, vias tented up to drill 20mil, thermal gap 10mil
Holes 3 mm at 3,3 177,3 177,117 3,117

### Footprints (pad centres in the part's own frame; a part is rotated, then mirrored left to right if it is on the bottom)
CR2032-SMD = smd 4 x 3.6: + -17,0; - 15,0
HDR40 = drill 1.016 octagon: 1 -24.13,-1.27; 2 -24.13,1.27; 3 -21.59,-1.27; 4 -21.59,1.27; 5 -19.05,-1.27; 6 -19.05,1.27; 7 -16.51,-1.27; 8 -16.51,1.27; 9 -13.97,-1.27; 10 -13.97,1.27; 11 -11.43,-1.27; 12 -11.43,1.27; 13 -8.89,-1.27; 14 -8.89,1.27; 15 -6.35,-1.27; 16 -6.35,1.27; 17 -3.81,-1.27; 18 -3.81,1.27; 19 -1.27,-1.27; 20 -1.27,1.27; 21 1.27,-1.27; 22 1.27,1.27; 23 3.81,-1.27; 24 3.81,1.27; 25 6.35,-1.27; 26 6.35,1.27; 27 8.89,-1.27; 28 8.89,1.27; 29 11.43,-1.27; 30 11.43,1.27; 31 13.97,-1.27; 32 13.97,1.27; 33 16.51,-1.27; 34 16.51,1.27; 35 19.05,-1.27; 36 19.05,1.27; 37 21.59,-1.27; 38 21.59,1.27; 39 24.13,-1.27; 40 24.13,1.27
E3,5-8 = drill 0.813 pad 1.6: + -1.778,0 | drill 0.813 pad 1.6 octagon: - 1.778,0
C050-025X075 = drill 0.813 octagon: 1 -2.54,0; 2 2.54,0
JP3Q = drill 0.914 octagon: 1 -2.54,-1.27; 2 -2.54,1.27; 3 0,-1.27; 4 0,1.27; 5 2.54,-1.27; 6 2.54,1.27
JP1 = drill 0.914 long: 1 0,-1.27; 2 0,1.27
JP2 = drill 0.914 long: 1 -2.54,0; 2 0,0; 3 2.54,0
0207/10 = drill 0.813 octagon: 1 -5.08,0; 2 5.08,0
RN-9 = drill 0.813 long: 1 -10.16,0; 2 -7.62,0; 3 -5.08,0; 4 -2.54,0; 5 0,0; 6 2.54,0; 7 5.08,0; 8 7.62,0; 9 10.16,0
RN-5 = drill 0.813 long: 1 -5.08,0; 2 -2.54,0; 3 0,0; 4 2.54,0; 5 5.08,0
PKM13EPYH400X = drill 0.8 octagon: 1 -2.5,0; 2 2.5,0
B3F-10XX = drill 1.016 long: 1 -3.251,2.261; 2 3.251,2.261; 3 -3.251,-2.261; 4 3.251,-2.261
EDG-04 = drill 0.813 long: 1 -3.81,-3.81; 2 -1.27,-3.81; 3 1.27,-3.81; 4 3.81,-3.81; 5 3.81,3.81; 6 1.27,3.81; 7 -1.27,3.81; 8 -3.81,3.81
EDG-08 = drill 0.813 long: 1 -8.89,-3.81; 2 -6.35,-3.81; 3 -3.81,-3.81; 4 -1.27,-3.81; 5 1.27,-3.81; 6 3.81,-3.81; 7 6.35,-3.81; 8 8.89,-3.81; 9 8.89,3.81; 10 6.35,3.81; 11 3.81,3.81; 12 1.27,3.81; 13 -1.27,3.81; 14 -3.81,3.81; 15 -6.35,3.81; 16 -8.89,3.81
TO92 = drill 0.813 octagon: 1 1.27,0; 2 0,1.905; 3 -1.27,0
DIL20 = drill 0.813 long: 1 -11.43,-3.81; 2 -8.89,-3.81; 3 -6.35,-3.81; 4 -3.81,-3.81; 5 -1.27,-3.81; 6 1.27,-3.81; 7 3.81,-3.81; 8 6.35,-3.81; 9 8.89,-3.81; 10 11.43,-3.81; 11 11.43,3.81; 12 8.89,3.81; 13 6.35,3.81; 14 3.81,3.81; 15 1.27,3.81; 16 -1.27,3.81; 17 -3.81,3.81; 18 -6.35,3.81; 19 -8.89,3.81; 20 -11.43,3.81
DIL28 = drill 0.813 long: 1 -16.51,-7.62; 2 -13.97,-7.62; 3 -11.43,-7.62; 4 -8.89,-7.62; 5 -6.35,-7.62; 6 -3.81,-7.62; 7 -1.27,-7.62; 8 1.27,-7.62; 9 3.81,-7.62; 10 6.35,-7.62; 11 8.89,-7.62; 12 11.43,-7.62; 13 13.97,-7.62; 14 16.51,-7.62; 15 16.51,7.62; 16 13.97,7.62; 17 11.43,7.62; 18 8.89,7.62; 19 6.35,7.62; 20 3.81,7.62; 21 1.27,7.62; 22 -1.27,7.62; 23 -3.81,7.62; 24 -6.35,7.62; 25 -8.89,7.62; 26 -11.43,7.62; 27 -13.97,7.62; 28 -16.51,7.62
DIL14 = drill 0.813 long: 1 -7.62,-3.81; 2 -5.08,-3.81; 3 -2.54,-3.81; 4 0,-3.81; 5 2.54,-3.81; 6 5.08,-3.81; 7 7.62,-3.81; 8 7.62,3.81; 9 5.08,3.81; 10 2.54,3.81; 11 0,3.81; 12 -2.54,3.81; 13 -5.08,3.81; 14 -7.62,3.81
DIL16 = drill 0.813 long: 1 -8.89,-3.81; 2 -6.35,-3.81; 3 -3.81,-3.81; 4 -1.27,-3.81; 5 1.27,-3.81; 6 3.81,-3.81; 7 6.35,-3.81; 8 8.89,-3.81; 9 8.89,3.81; 10 6.35,3.81; 11 3.81,3.81; 12 1.27,3.81; 13 -1.27,3.81; 14 -3.81,3.81; 15 -6.35,3.81; 16 -8.89,3.81
DIL28-6 = drill 0.813 long: 1 -16.51,-7.62; 2 -13.97,-7.62; 3 -11.43,-7.62; 4 -8.89,-7.62; 5 -6.35,-7.62; 6 -3.81,-7.62; 7 -1.27,-7.62; 8 1.27,-7.62; 9 3.81,-7.62; 10 6.35,-7.62; 11 8.89,-7.62; 12 11.43,-7.62; 13 13.97,-7.62; 14 16.51,-7.62; 15 16.51,7.62; 16 13.97,7.62; 17 11.43,7.62; 18 8.89,7.62; 19 6.35,7.62; 20 3.81,7.62; 21 1.27,7.62; 22 -1.27,7.62; 23 -3.81,7.62; 24 -6.35,7.62; 25 -8.89,7.62; 26 -11.43,7.62; 27 -13.97,7.62; 28 -16.51,7.62
DIL-08 = drill 0.813 long: 1 -3.81,-3.81; 2 -1.27,-3.81; 3 1.27,-3.81; 4 3.81,-3.81; 5 3.81,3.81; 6 1.27,3.81; 7 -1.27,3.81; 8 -3.81,3.81
TC38H = drill 0.813: 1 -1.27,0; 2 1.27,0
DIL14S = drill 0.813: 1 -7.62,-3.81; 7 7.62,-3.81; 8 7.62,3.81; 14 -7.62,3.81

### Placement (x,y rotation side)
BAT1  167.64,63.5 270 top
BUS  5.08,60 90 top
C1  7.62,27.94 270 top
C2  19.05,101.6 180 top
C3  19.05,63.5 180 top
C4  19.05,30.48 180 top
C5  44.45,101.6 180 top
C6  130.81,66.04 90 top
C7  114.3,25.4 180 top
C8  127,25.4 180 top
C9  69.85,101.6 180 top
C10  151.13,76.2 180 top
C11  31.75,101.6 180 top
C12  54.61,25.4 180 top
C13  41.91,25.4 180 top
C17  57.15,101.6 180 top
C18  82.55,101.6 180 top
C19  106.68,21.59 270 top
C20  49.53,63.63 180 top
C21  64.77,63.63 180 top
C22  80.01,63.63 180 top
C23  95.25,63.63 180 top
C24  34.29,63.5 180 top
C26  152.4,25.4 180 top
C27  160.02,12.7 270 top
C28  152.4,6.35 180 top
JP1  137.16,20.32 270 top
JP2  139.7,36.83 270 top
JP3  167.64,13.97 0 top
JP4  105.41,43.18 0 top
R1  166.37,29.21 180 top
R2  166.37,20.95 0 top
R4  152.4,11.43 0 top
R5  152.4,8.89 180 top
RN1  26.67,48.26 270 top
RN2  130.81,55.88 270 top
RN3  41.91,50.8 270 top
RN4  57.15,50.8 270 top
RN5  72.39,50.8 270 top
RN6  87.63,50.8 270 top
SG1  166.37,38.1 0 top
SW1  27.94,110.49 0 top
SW2  40.64,110.49 0 top
SW3  53.34,110.49 0 top
SW4  15.24,110.49 0 top
SW5  82.55,110.49 0 top
SW6  109.22,110.49 0 top
SW7  133.35,110.49 0 top
SW8  157.48,110.49 0 top
T1  166.37,25.4 180 top
U1  19.05,49.53 270 top
U2  19.05,87.63 270 top
U3  19.05,16.51 270 top
U4  44.45,87.63 270 top
U5  119.38,57.15 270 top
U6  114.3,15.24 270 top
U7  127,13.97 270 top
U8  69.85,87.63 270 top
U9  146.05,57.15 270 top
U10  31.75,87.63 270 top
U11  54.61,15.24 270 top
U12  41.91,15.24 270 top
U16  57.15,87.63 270 top
U17  82.55,90.17 270 top
U19  49.53,49.53 270 top
U20  64.77,49.53 270 top
U21  80.01,49.53 270 top
U22  95.25,49.53 270 top
U23  34.29,49.53 270 top
U24  152.4,19.05 270 top
X1  146.05,69.85 180 top
Y1  99.06,15.24 270 top

### Tracks (layer width: path | path; a pad name or v marks a point on that pad's centre or on a via)
!IEO!  (via drill 0.5)
  Top 0.254: v13.84,34.29 14.35,34.29 14.86,33.78 23.24,33.78 27.3,29.72 112.33,29.72 112.98,30.37 115.28,30.37 115.77,29.88 115.77,29.86 v116.09,29.54
  Bottom 0.254: BUS.15 7.31,53.65 8.38,52.58 8.38,39.79 9.14,39.03 9.14,35.98 11.34,33.78 13.34,33.78 v13.84,34.29 | U5.11 113.23,48.26 115.51,45.97 115.51,30.14 115.77,29.88 115.77,29.86 v116.09,29.54
!INT!  (via drill 0.5)
  Top 0.254: v13.86,33.13 14.01,33.27 23.03,33.27 27.09,29.21 112.54,29.21 113.19,29.86 114.61,29.86 v114.94,29.54
  Bottom 0.254: BUS.11 7.31,48.57 7.87,48.01 7.87,39.58 8.64,38.82 8.64,35.77 11.28,33.13 v13.86,33.13 | U5.12 113.23,45.72 115,43.94 115,29.61 v114.94,29.54
!IORQ!  (via drill 0.5)
  Top 0.254: U10.1 31.11,99.06 32.38,97.79 37.47,97.79 38.73,99.06 U4.1 43.81,99.06 45.09,97.79 50.16,97.79 51.44,99.06 U16.1 56.52,99.06 57.78,97.79 62.87,97.79 64.14,99.06 U8.1 | v116.35,34.02 115.89,33.56 112.54,33.56 111.25,32.27 100.81,32.27 99.66,33.42 98.46,33.42 97.81,32.77 85.33,32.77 84.17,33.93 83.47,33.93 82.82,33.27 70.3,33.27 69.14,34.43 68.02,34.43 67.37,33.78 61.45,33.78 60.8,34.43 51.2,34.43 50.55,33.78 42.27,33.78 41.11,34.94 39.05,34.94 38.4,34.29 36.12,34.29 35.2,35.21 33.62,35.21 31.9,33.49 29.59,33.49 29.06,32.97 26.97,32.97 24.12,35.81 20.95,35.81 20.23,36.54 v19.05,36.54
  Bottom 0.254: U3.16 20.32,17.78 19.3,18.8 19.3,33.4 19.05,33.66 v19.05,36.54 19.05,96.52 20.32,97.79 24.77,97.79 26.04,99.06 U10.1 | U5.10 113.28,50.8 116.02,48.06 116.02,34.85 116.35,34.52 v116.35,34.02
!M1!  (via drill 0.5)
  Top 0.254: v27.9,31.06 28.54,31.06 28.86,30.73 111.91,30.73 112.56,31.39 113.84,31.39 v114.17,31.71
  Bottom 0.254: U3.18 20.7,22.86 19.81,23.75 19.81,31.37 20.95,32.51 24.93,32.51 26.38,31.06 v27.9,31.06 | U5.14 113.23,40.64 114.5,39.37 114.5,32.04 v114.17,31.71
!OBD!  (via drill 0.5)
  Top 0.254: v40.13,32.58 39.57,32.58 39.24,32.26 31.34,32.26 30.62,32.98 29.8,32.98 29.27,32.46 26.76,32.46 23.91,35.31 20.21,35.31 v19.88,35.63
  Bottom 0.254: U12.8 43.43,7.62 41.02,10.03 41.02,26.92 40.13,27.81 v40.13,32.58 | v19.88,35.63 19.88,37.01 19.56,37.34 19.56,56.64 21.34,58.42 U1.19
!RD!  (via drill 0.5)
  Top 0.254: v150.75,29.72 130.75,29.72 130.1,30.37 128.98,30.37 128.33,29.72 118.27,29.72 v117.24,30.75 115.44,32.55 113,32.55 111.7,31.24 29.07,31.24 28.36,31.95 26.55,31.95 23.7,34.8 18.8,34.8 v18.12,35.48
  Bottom 0.254: U3.15 20.32,15.24 18.8,16.76 18.8,32.77 18.12,33.45 v18.12,35.48 18.12,36.91 18.54,37.34 18.54,59.18 16.76,60.96 U1.1 | U5.6 113.28,60.96 113.79,60.45 113.79,54.1 117.04,50.86 117.04,35.35 118.02,34.37 118.02,32.1 117.24,31.32 v117.24,30.75 | v150.75,29.72 150.75,57.02 152.15,58.42 U9.22
!RESET!  (via drill 0.5)
  Top 0.254: v15.08,32.44 15.4,32.77 22.82,32.77 26.88,28.7 42.09,28.7 v42.42,28.38 42.74,28.7 113.21,28.7 v113.54,29.03 113.86,28.7 129.21,28.7 v129.54,29.03 | U7.10 127.64,7.62 126.36,8.89 115.57,8.89 | 114.3,18.41 116.2,20.32 U6.13 | U5.17 v129.54,45.72
  Top 0.305: 115.57,8.89 109.22,8.89 108.58,9.53 108.58,15.88 109.22,16.51 112.39,16.51 114.3,18.41
  Bottom 0.254: BUS.6 5.14,39.62 7.11,39.62 8.13,38.61 8.13,35.56 11.39,32.3 14.21,32.3 14.35,32.44 v15.08,32.44 | v113.54,29.03 113.54,22.86 | 113.54,22.86 U6.1 | U6.13 114.94,20.32 113.54,21.72 113.54,22.86 | v129.54,45.72 129.54,36.83 | 129.54,36.83 v129.54,29.03 | U12.12 43.31,17.78 42.04,19.05 42.04,27.43 42.42,27.81 v42.42,28.38 | JP2.1 129.54,36.83
!WR!  (via drill 0.5)
  Top 0.254: v148.97,28.88 148.65,29.21 130.54,29.21 129.89,29.86 129.19,29.86 128.54,29.21 117.6,29.21 115.93,30.88 112.77,30.88 112.12,30.23 27.52,30.23 23.45,34.29 16.09,34.29 v15.77,34.62
  Bottom 0.254: U3.14 20.32,12.7 18.29,14.73 18.29,32.09 v15.77,34.62 | U9.27 152.15,71.12 149.73,68.71 149.73,31.83 148.97,31.07 v148.97,28.88
+5V
  pour Route3: -10.16,132.72 192.41,132.72 192.41,-13.34 -10.16,-13.34
A0  (via drill 0.5)
  Top 0.254: U2.18 23.5,93.98 26.04,96.52 U10.2 31.11,96.52 32.38,95.25 62.23,95.25 64.77,97.79 75.56,97.79 76.83,99.06 U17.1 81.92,99.06 83.19,97.79 87.63,97.79 92.2,93.22 92.2,80.56 93.64,79.12 120.55,79.12 v120.88,79.45 | U5.18 133.35,48.26 135.89,50.8 U9.10
  Bottom 0.254: v120.88,79.45 121.18,79.15 121.18,77.75 122.43,76.5 122.43,51.31 125.48,48.26 U5.18
A1  (via drill 0.5)
  Top 0.254: U2.17 23.5,91.44 24.77,92.71 31.11,92.71 32.38,91.44 U10.17 37.47,91.44 38.73,92.71 62.23,92.71 64.77,95.25 75.56,95.25 76.83,96.52 U17.2 81.92,96.52 83.19,95.25 87.63,95.25 91.69,91.19 91.69,80.35 93.43,78.61 116.71,78.61 121.69,78.61 v122.01,78.94 | U9.9 135.89,53.34 132.08,49.53 128.91,49.53 127.64,50.8 U5.19
  Bottom 0.254: v122.01,78.94 122.31,78.64 122.31,77.34 122.94,76.72 122.94,53.34 125.48,50.8 U5.19
A2  (via drill 0.5)
  Top 0.254: U2.16 23.5,88.9 26.04,91.44 U10.4 31.11,91.44 32.38,90.17 37.47,90.17 38.73,91.44 U4.4 43.81,91.44 45.09,90.17 62.23,90.17 64.77,92.71 75.56,92.71 76.83,93.98 U17.3 81.92,93.98 83.19,92.71 87.63,92.71 91.19,89.15 91.19,80.14 93.22,78.11 122.82,78.11 v123.14,78.43 | U9.8 135.25,55.88 133.99,54.61 129.67,54.61 128.91,55.37 128.91,56.39 128.14,57.15 v125.09,57.15
  Bottom 0.254: v123.14,78.43 123.14,77.97 123.12,77.94 123.12,77.25 123.44,76.92 123.44,59.05 | 123.44,58.8 123.44,59.05 | 123.44,58.8 123.44,59.05 | v125.09,57.15 123.44,58.8
A3  (via drill 0.5)
  Top 0.254: U2.15 23.5,86.36 24.77,87.63 31.11,87.63 32.38,86.36 U10.15 37.47,86.36 38.73,87.63 43.81,87.63 45.09,86.36 U4.15 50.16,86.36 51.44,87.63 56.52,87.63 57.78,86.36 U16.15 62.87,86.36 64.14,87.63 74.93,87.63 77.47,90.17 87.63,90.17 90.68,87.12 90.68,79.88 92.96,77.6 v123.95,77.6 | U9.7 137.79,58.42 136.53,57.15 129.67,57.15 128.91,57.91 128.91,58.93 128.14,59.69 v125.09,59.69
  Bottom 0.254: v123.95,77.6 123.95,60.83 v125.09,59.69
A4
  Top 0.254: U2.14 23.5,83.82 26.04,86.36 U10.6 31.11,86.36 32.38,85.09 37.47,85.09 38.73,86.36 U4.6 43.81,86.36 45.09,85.09 50.16,85.09 51.44,86.36 U16.6 56.52,86.36 57.78,85.09 62.87,85.09 64.14,86.36 U8.6
A5
  Top 0.254: U2.13 23.5,81.28 24.77,82.55 31.11,82.55 32.38,81.28 U10.13 37.47,81.28 38.73,82.55 43.81,82.55 45.09,81.28 U4.13 50.16,81.28 51.44,82.55 56.52,82.55 57.78,81.28 U16.13 62.87,81.28 64.14,82.55 69.22,82.55 70.48,81.28 U8.13
A6
  Top 0.254: U2.12 23.5,78.74 26.04,81.28 U10.8 31.11,81.28 32.38,80.01 37.47,80.01 38.73,81.28 U4.8 43.81,81.28 45.09,80.01 50.16,80.01 51.44,81.28 U16.8 56.52,81.28 57.78,80.01 62.87,80.01 64.14,81.28 U8.8
A7
  Top 0.254: U2.11 23.5,76.2 24.77,77.47 31.11,77.47 32.38,76.2 U10.11 37.47,76.2 38.73,77.47 43.81,77.47 45.09,76.2 U4.11 50.16,76.2 51.44,77.47 56.52,77.47 57.78,76.2 U16.11 62.87,76.2 64.14,77.47 69.22,77.47 70.48,76.2 U8.11
CLK  (via drill 0.5)
  Top 0.254: v17.27,31.93 17.6,32.26 22.61,32.26 26.67,28.19 34.44,28.19 35.59,27.03 36.29,27.03 36.94,27.69 40.16,27.69 40.81,27.03 42.26,27.03 43.42,28.19 126.67,28.19 v127,27.87
  Bottom 0.254: U3.11 19.68,5.08 17.78,6.99 17.78,31.42 v17.27,31.93 | v127,27.87 U5.15
CTC_CH2  (via drill 0.5)
  Top 0.254: JP3.3 170.18,16.64 168.28,18.54 160.27,18.54 159.26,19.56 159.26,28.83 156.7,31.39 149.57,31.39 148.92,30.73 131.17,30.73 130.52,31.39 128.56,31.39 127.91,30.73 119.66,30.73 v117.18,33.21
  Bottom 0.254: v117.18,33.21 | v117.18,33.21 117.18,34.49 116.53,35.14 116.53,50.09 113.28,53.34 U5.9
D0
  Top 0.254: U1.18 RN1.2 27.3,55.88 29.84,58.42 U23.2 33.66,58.42 34.92,57.15 48.9,57.15 50.16,58.42 U19.19 53.98,58.42 55.24,57.15 64.14,57.15 65.41,58.42 U20.19 69.22,58.42 70.48,57.15 79.38,57.15 80.64,58.42 U21.19 84.45,58.42 85.72,57.15 94.61,57.15 95.89,58.42 U22.19
D0`  (via drill 0.5)
  Top 0.254: BUS.30 5.1,72.72 32.69,72.72 34.67,70.74 56.9,70.74 58.17,69.47 77.72,69.47 79.88,71.63 103.38,71.63 v105.41,73.66 | v114.68,64.77 118.49,64.77 119.76,66.04 U5.25
  Bottom 0.254: BUS.30 5.1,72.72 6.91,72.72 12.57,67.06 12.57,59.56 13.72,58.42 U1.2 | U9.11 139.19,48.26 140.46,49.53 140.46,53.59 139.45,54.61 134.87,54.61 133.22,56.26 133.22,64.26 131.44,66.04 U5.25 | v105.41,73.66 105.41,69.72 110.36,64.77 v114.68,64.77
D1
  Top 0.254: U1.17 RN1.3 27.3,53.34 29.84,55.88 U23.3 33.66,55.88 34.92,54.61 48.9,54.61 50.16,55.88 U19.18 53.98,55.88 55.24,54.61 64.14,54.61 65.41,55.88 U20.18 69.22,55.88 70.48,54.61 79.38,54.61 80.64,55.88 U21.18 84.45,55.88 85.72,54.61 94.61,54.61 95.89,55.88 U22.18
D1`  (via drill 0.5)
  Top 0.254: BUS.29 7.29,71.43 8.08,72.21 32.48,72.21 34.46,70.23 56.69,70.23 57.96,68.96 77.93,68.96 80.09,71.12 104.14,71.12 v106.68,73.66 | v114.68,67.31 118.49,67.31 119.76,68.58 U5.26
  Bottom 0.254: BUS.29 7.31,71.43 12.06,66.67 12.06,57.53 13.72,55.88 U1.3 | U9.12 140.97,48.26 140.97,55.63 139.45,57.15 134.75,57.15 133.73,58.17 133.73,64.47 131.66,66.55 129.67,66.55 127.64,68.58 U5.26 | v106.68,73.66 106.68,70.99 110.36,67.31 v114.68,67.31
D2
  Top 0.254: U1.16 RN1.4 27.3,50.8 29.84,53.34 U23.4 33.66,53.34 34.92,52.07 48.9,52.07 50.16,53.34 U19.17 53.98,53.34 55.24,52.07 64.14,52.07 65.41,53.34 U20.17 69.22,53.34 70.48,52.07 79.38,52.07 80.64,53.34 U21.17 84.45,53.34 85.72,52.07 94.61,52.07 95.89,53.34 U22.17
D2`  (via drill 0.5)
  Top 0.254: BUS.28 5.1,70.18 7.04,70.18 8.56,71.7 32.27,71.7 34.25,69.72 56.48,69.72 57.74,68.45 78.14,68.45 80.3,70.61 104.9,70.61 v107.95,73.66 | v114.68,69.85 118.49,69.85 119.76,71.12 U5.27
  Bottom 0.254: BUS.28 5.1,70.18 7.04,70.18 11.56,65.66 11.56,55.5 13.72,53.34 U1.4 | U9.13 141.48,46.23 141.48,57.66 139.45,59.69 135.38,59.69 134.24,60.83 134.24,64.68 131.87,67.06 129.88,67.06 129.29,67.65 129.29,69.47 127.64,71.12 U5.27 | v107.95,73.66 107.95,72.26 110.36,69.85 v114.68,69.85
D3
  Top 0.254: U1.15 RN1.5 27.3,48.26 29.84,50.8 U23.5 33.66,50.8 34.92,49.53 48.9,49.53 50.16,50.8 U19.16 53.98,50.8 55.24,49.53 64.14,49.53 65.41,50.8 U20.16 69.22,50.8 70.48,49.53 79.38,49.53 80.64,50.8 U21.16 84.45,50.8 85.72,49.53 94.61,49.53 95.89,50.8 U22.16
D3`  (via drill 0.5)
  Top 0.254: BUS.27 7.29,68.89 9.6,71.2 32.06,71.2 34.04,69.22 56.27,69.22 57.53,67.94 78.36,67.94 80.51,70.1 105.63,70.1 v109.2,73.68 | U9.15 v148.46,40.64 | v114.68,72.39 118.49,72.39 119.76,73.66 U5.28
  Bottom 0.254: BUS.27 7.31,68.89 11.05,65.15 11.05,53.47 13.72,50.8 U1.5 | v148.46,40.64 148.46,44.58 144.4,48.64 144.4,59.05 141.22,62.23 135.76,62.23 134.75,63.25 134.75,64.89 132.46,67.18 132.46,72.52 131.32,73.66 U5.28 | v109.2,73.68 110.49,72.39 v114.68,72.39
D4
  Top 0.254: U1.14 RN1.6 27.3,45.72 29.84,48.26 U23.6 33.66,48.26 34.92,46.99 48.9,46.99 50.16,48.26 U19.15 53.98,48.26 55.24,46.99 64.14,46.99 65.41,48.26 U20.15 69.22,48.26 70.48,46.99 79.38,46.99 80.64,48.26 U21.15 84.45,48.26 85.72,46.99 94.61,46.99 95.89,48.26 U22.15
D4`  (via drill 0.5)
  Top 0.254: BUS.26 5.1,67.64 6.91,67.64 9.96,70.69 31.85,70.69 33.83,68.71 56.05,68.71 57.32,67.44 78.57,67.44 80.72,69.6 106.3,69.6 110.36,73.66 U5.1 | U9.16 147.32,43.18 146.05,41.91 v121.41,41.91
  Bottom 0.254: BUS.26 5.1,67.64 6.91,67.64 10.54,64.01 10.54,51.44 13.72,48.26 U1.6 | U5.1 116.84,73.66 121.41,69.09 v121.41,41.91
D5
  Top 0.254: U1.13 RN1.7 27.3,43.18 29.84,45.72 U23.7 33.66,45.72 34.92,44.45 48.9,44.45 50.16,45.72 U19.14 53.98,45.72 55.24,44.45 64.14,44.45 65.41,45.72 U20.14 69.22,45.72 70.48,44.45 79.38,44.45 80.64,45.72 U21.14 84.45,45.72 85.72,44.45 94.61,44.45 95.89,45.72 U22.14
D5`  (via drill 0.5)
  Top 0.254: BUS.25 7.29,66.35 11.12,70.18 31.64,70.18 33.62,68.2 55.84,68.2 57.11,66.93 78.78,66.93 80.94,69.09 108.29,69.09 110.32,71.12 U5.2 | U9.17 147.32,45.72 146.05,44.45 v120.52,44.45
  Bottom 0.254: BUS.25 7.31,66.35 10.03,63.63 10.03,49.4 13.72,45.72 U1.7 | v120.52,44.45 120.52,45.09 120.9,45.47 120.9,67.06 116.84,71.12 U5.2
D6
  Top 0.254: U1.12 RN1.8 27.3,40.64 29.84,43.18 U23.8 33.66,43.18 34.92,41.91 48.9,41.91 50.16,43.18 U19.13 53.98,43.18 55.24,41.91 64.14,41.91 65.41,43.18 U20.13 69.22,43.18 70.48,41.91 79.38,41.91 80.64,43.18 U21.13 84.45,43.18 85.72,41.91 94.61,41.91 95.89,43.18 U22.13
D6`  (via drill 0.5)
  Top 0.254: BUS.24 5.1,65.1 6.91,65.1 11.48,69.67 31.43,69.67 33.41,67.69 55.63,67.69 56.9,66.42 78.99,66.42 81.15,68.58 U5.3 | U9.18 147.32,48.26 146.05,46.99 v120.02,46.99
  Bottom 0.254: BUS.24 5.1,65.1 6.91,65.1 9.53,62.48 9.53,47.37 13.72,43.18 U1.8 | v120.02,46.99 120.02,47.62 120.4,48.01 120.4,65.02 116.84,68.58 U5.3
D7
  Top 0.254: U1.11 RN1.9 27.3,38.1 29.84,40.64 U23.9 33.66,40.64 34.92,39.37 48.9,39.37 50.16,40.64 U19.12 53.98,40.64 55.24,39.37 64.14,39.37 65.41,40.64 U20.12 69.22,40.64 70.48,39.37 79.38,39.37 80.64,40.64 U21.12 84.45,40.64 85.72,39.37 94.61,39.37 95.89,40.64 U22.12
D7`  (via drill 0.5)
  Top 0.254: BUS.23 7.29,63.81 12.65,69.16 31.22,69.16 33.2,67.18 55.42,67.18 56.69,65.91 79.2,65.91 81.36,68.07 108.2,68.07 110.24,66.04 U5.4 | U9.19 146.69,50.8 145.41,52.07 135.89,52.07 132.72,48.9 128.82,48.9 128.19,49.53 v119.56,49.53
  Bottom 0.254: BUS.23 7.31,63.81 9.02,62.1 9.02,45.34 13.72,40.64 U1.9 | v119.56,49.53 119.56,50.22 119.89,50.55 119.89,62.99 116.84,66.04 U5.4
GND  (via drill 0.5)
  Top 0.762: BAT1.- 162.96,48.5 158.12,53.34 U9.20
  other vias: 147.32,57.47
  pour Route2: -5.71,127.64 186.69,127.64 186.69,-7.62 -5.71,-7.62
  pour Top: 143.83,68.58 148.27,68.58 148.27,56.52 143.83,56.52
N$1
  Bottom 0.254: U6.2 113.03,20.32 114.3,19.05 114.3,15.24 | 114.3,15.24 U6.11 | U6.6 113.03,10.16 114.3,11.43 114.3,15.24
N$2
  Top 0.254: U9.2 146.05,71.12 X1.1
N$3  (via drill 0.5)
  Top 0.254: v30.14,32.15 30.73,32.15 31.13,31.75 56.16,31.75 57.32,32.91 60.17,32.91 60.82,32.26 98.06,32.26 98.71,32.91 99.41,32.91 100.57,31.75 111.49,31.75 112.79,33.05 116.12,33.05 118.94,30.23 128.12,30.23 128.77,30.88 130.31,30.88 130.96,30.23 149.59,30.23 v149.91,30.55
  Bottom 0.254: U10.19 33.02,96.52 31.75,95.25 31.75,73.66 33.53,71.88 33.53,56.77 33.1,56.34 33.1,36.21 30.14,33.26 v30.14,32.15 | v149.91,30.55 149.91,31.3 150.24,31.62 150.24,59.05 152.15,60.96 U9.23
N$4
  Top 0.254: U9.3 142.24,68.58 143.51,69.85 X1.2
N$5
  Top 0.254: U12.9 47.62,10.16 48.9,8.89 53.98,8.89 55.24,7.62 U11.8
N$6
  Top 0.762: U9.24 163.19,63.5 167.64,67.94 BAT1.+
N$7  (via drill 0.5)
  Top 0.254: U9.21 149.28,55.88 v148.9,55.5 | v146.69,75.95 121.35,75.95 121.33,75.93 120.58,75.93 119.93,76.58 82.04,76.58 81.08,75.62 81.08,74.96 80.29,74.17 79.37,74.17 76.45,71.25 71.83,71.25 v71.5,70.92
  Bottom 0.254: v71.5,70.92 71.5,95.89 72.14,96.52 U8.19 | v148.9,55.5 148.9,72.64 146.69,74.86 v146.69,75.95
N$8  (via drill 0.5)
  Top 0.254: v41.28,27.87 40.96,28.19 36.27,28.19 v35.94,27.87
  Bottom 0.254: U12.11 43.56,15.24 41.53,17.27 41.53,27.62 v41.28,27.87 | v35.94,27.87 35.94,28.49 36.2,28.75 36.2,37.72 36.58,38.1 U23.11
N$9
  Top 0.305: U6.5 113.67,12.7 114.94,13.97 119.38,13.97 121.92,16.51 125.73,16.51 128.27,19.05 132.72,19.05 133.99,20.32 JP1.3
N$10  (via drill 0.5)
  Top 0.254: U17.4 76.83,91.44 75.56,90.17 64.77,90.17 62.23,87.63 v58.42,87.63
  Bottom 0.254: U16.19 59.05,96.52 58.42,95.89 v58.42,87.63
N$11
  Top 0.254: U5.22 127.25,58.42 | 127.25,58.42 127.64,58.42 130.18,55.88 RN2.3 | 127.25,58.42 124.46,58.42 115.57,49.53 110.49,49.53 JP4.4
N$12
  Top 0.254: RN4.2 U20.2
  Bottom 0.254: U20.2 62.36,58.42 62.48,58.42 62.87,58.8 62.87,62.74 63.37,63.25 63.37,65.79 66.8,69.22 75.82,69.22 80.26,73.66 89.92,73.66 91.82,75.56 91.82,92.96 100.33,101.47 SW6.1
N$13
  Top 0.254: RN4.3 U20.3
  Bottom 0.254: U20.3 62.36,55.88 63.37,56.9 63.37,62.53 63.88,63.04 63.88,65.58 67.01,68.71 76.03,68.71 80.47,73.15 90.13,73.15 92.33,75.36 92.33,92.71 102.87,103.25 SW6.2
N$14
  Top 0.254: RN4.4 U20.4
  Bottom 0.254: U20.4 62.36,53.34 63.88,54.86 63.88,62.32 64.39,62.83 64.39,65.36 67.22,68.2 76.24,68.2 80.69,72.64 90.34,72.64 92.84,75.14 92.84,92.46 105.41,105.03 SW6.3
N$15
  Top 0.254: RN4.5 U20.5
  Bottom 0.254: U20.5 62.36,50.8 64.39,52.83 64.39,62.11 64.9,62.62 64.9,65.16 67.43,67.69 76.45,67.69 80.89,72.14 90.55,72.14 93.34,74.93 93.34,92.21 104.26,103.12 105.92,103.12 107.95,105.16 SW6.4
N$16
  Top 0.254: RN4.6 U20.6
  Bottom 0.254: U20.6 62.36,48.26 64.9,50.8 64.9,61.9 65.41,62.4 65.41,64.94 67.64,67.18 76.66,67.18 81.11,71.63 90.76,71.63 93.85,74.72 93.85,92 104.47,102.62 107.95,102.62 110.49,105.16 SW6.5
N$17
  Top 0.254: RN4.7 U20.7
  Bottom 0.254: U20.7 62.36,45.72 65.41,48.77 65.41,61.69 65.91,62.19 65.91,64.73 67.85,66.67 76.87,66.67 81.32,71.12 90.97,71.12 94.36,74.51 94.36,91.78 104.68,102.11 109.98,102.11 113.03,105.16 SW6.6
N$18
  Top 0.254: RN4.8 U20.8
  Bottom 0.254: U20.8 62.36,43.18 65.91,46.74 65.91,61.48 67.02,62.59 68.17,62.59 68.71,63.12 68.71,64.52 70.36,66.17 77.08,66.17 81.53,70.61 91.18,70.61 94.87,74.3 94.87,91.57 104.89,101.6 112.01,101.6 115.57,105.16 SW6.7
N$19
  Top 0.254: RN4.9 U20.9
  Bottom 0.254: U20.9 62.36,40.64 66.42,44.7 66.42,61.27 67.23,62.08 68.38,62.08 69.22,62.91 69.22,64.31 70.57,65.66 77.29,65.66 81.74,70.1 91.39,70.1 95.38,74.09 95.38,91.36 105.11,101.09 114,101.09 118.11,105.2 SW6.8
N$20
  Top 0.254: RN5.2 U21.2
  Bottom 0.254: U21.2 77.72,58.42 78.11,58.8 78.11,62.74 78.61,63.25 78.61,66.26 81.95,69.6 91.6,69.6 95.89,73.88 95.89,91.15 105.31,100.58 119.89,100.58 124.46,105.16 SW7.1
N$21
  Top 0.254: RN5.3 U21.3
  Bottom 0.254: U21.3 77.6,55.88 78.61,56.9 78.61,62.53 79.12,63.04 79.12,66.05 82.16,69.09 91.81,69.09 96.39,73.67 96.39,90.94 105.53,100.08 121.92,100.08 127,105.16 SW7.2
N$22
  Top 0.254: RN5.4 U21.4
  Bottom 0.254: U21.4 77.6,53.34 79.12,54.86 79.12,62.32 79.63,62.83 79.63,65.84 82.37,68.58 92.02,68.58 96.9,73.46 96.9,90.73 105.74,99.57 123.95,99.57 129.54,105.16 SW7.3
N$23
  Top 0.254: RN5.5 U21.5
  Bottom 0.254: U21.5 77.6,50.8 79.63,52.83 79.63,62.11 80.14,62.62 80.14,65.63 82.58,68.07 92.23,68.07 97.41,73.25 97.41,90.52 105.95,99.06 125.98,99.06 132.08,105.16 SW7.4
N$24
  Top 0.254: RN5.6 U21.6
  Bottom 0.254: U21.6 77.6,48.26 80.14,50.8 80.14,61.9 80.64,62.4 80.64,65.42 82.79,67.56 92.44,67.56 97.92,73.04 97.92,90.31 106.16,98.55 128.02,98.55 134.62,105.16 SW7.5
N$25
  Top 0.254: RN5.7 U21.7
  Bottom 0.254: U21.7 77.6,45.72 80.64,48.77 80.64,61.69 81.15,62.19 81.15,65.21 83,67.06 92.65,67.06 98.42,72.83 98.42,90.1 106.37,98.04 130.05,98.04 137.16,105.16 SW7.6
N$26
  Top 0.254: RN5.8 U21.8
  Bottom 0.254: U21.8 77.6,43.18 81.15,46.74 81.15,61.48 82.26,62.59 83.54,62.59 83.95,62.99 83.95,64.64 85.85,66.55 92.86,66.55 98.93,72.62 98.93,89.89 106.58,97.54 132.08,97.54 139.7,105.16 SW7.7
N$27
  Top 0.254: RN5.9 U21.9
  Bottom 0.254: U21.9 77.6,40.64 81.66,44.7 81.66,61.27 82.47,62.08 83.75,62.08 84.45,62.78 84.45,64.43 86.06,66.04 93.07,66.04 96.32,69.29 99.44,72.41 99.44,89.68 106.79,97.03 134.11,97.03 142.24,105.16 SW7.8
N$28
  Top 0.254: RN6.2 U22.2
  Bottom 0.254: U22.2 92.84,58.42 93.34,58.93 93.34,62.74 93.85,63.25 93.85,66.1 99.95,72.2 99.95,89.41 107.06,96.52 139.95,96.52 148.59,105.16 SW8.1
N$29
  Top 0.254: RN6.3 U22.3
  Bottom 0.254: U22.3 92.84,55.88 93.85,56.9 93.85,62.53 94.36,63.04 94.36,65.89 100.46,71.99 100.46,89.2 107.27,96.01 141.99,96.01 151.13,105.16 SW8.2
N$30
  Top 0.254: RN6.4 U22.4
  Bottom 0.254: U22.4 92.84,53.34 94.36,54.86 94.36,62.32 94.87,62.83 94.87,65.68 100.97,71.78 100.97,88.99 107.48,95.5 144.02,95.5 153.67,105.16 SW8.3
N$31
  Top 0.254: RN6.5 U22.5
  Bottom 0.254: U22.5 92.84,50.8 94.87,52.83 94.87,62.11 95.38,62.62 95.38,65.47 101.47,71.57 101.47,88.78 107.69,95 146.05,95 156.21,105.16 SW8.4
N$32
  Top 0.254: RN6.6 U22.6
  Bottom 0.254: U22.6 92.84,48.26 95.38,50.8 95.38,61.9 95.89,62.4 95.89,65.26 101.98,71.36 101.98,88.57 107.9,94.49 148.08,94.49 158.75,105.16 SW8.5
N$33
  Top 0.254: RN6.7 U22.7
  Bottom 0.254: U22.7 92.84,45.72 95.89,48.77 95.89,61.69 96.39,62.19 96.39,65.05 102.49,71.15 102.49,88.36 108.11,93.98 150.11,93.98 161.29,105.16 SW8.6
N$34
  Top 0.254: RN6.8 U22.8
  Bottom 0.254: U22.8 92.84,43.18 96.39,46.74 96.39,61.48 97.5,62.59 98.65,62.59 99.19,63.12 99.19,67.13 103,70.94 103,88.14 108.32,93.47 152.15,93.47 163.83,105.16 SW8.7
N$35
  Top 0.254: RN6.9 U22.9
  Bottom 0.254: U22.9 92.84,40.64 96.9,44.7 96.9,61.27 97.71,62.08 98.86,62.08 99.69,62.91 99.69,66.92 103.5,70.72 103.5,87.94 108.53,92.96 154.18,92.96 166.37,105.16 SW8.8
N$36
  Top 0.305: U6.9 118.75,10.16 120.02,11.43 124.46,11.43 129.54,16.51 132.72,16.51 133.99,17.78 JP1.5
N$37
  Top 0.254: RN3.2 U19.2
  Bottom 0.254: U19.2 47.24,58.42 47.75,58.93 47.75,62.79 48.16,63.2 48.16,66.78 43.05,71.88 43.05,105.66 42.04,106.68 33.53,106.68 31.98,108.23 SW1.4
N$38
  Top 0.254: RN3.3 U19.3
  Bottom 0.254: U19.3 47.24,55.88 48.26,56.9 48.26,62.58 48.67,62.98 48.67,66.99 43.56,72.09 | SW2.4 43.89,106.03 43.56,105.7 43.56,72.14 | 43.56,72.09 43.56,72.14 | 43.56,72.14 43.56,72.09
N$39
  Top 0.254: RN3.4 U19.4
  Bottom 0.254: U19.4 47.24,53.34 48.77,54.86 48.77,62.37 49.17,62.77 49.17,67.2 44.07,72.3 44.07,105.41 45.87,107.21 48.31,107.21 49.33,108.23 SW3.3
N$40
  Top 0.254: RN3.5 U19.5
  Bottom 0.254: U19.5 47.24,50.8 49.28,52.83 49.28,62.16 49.68,62.56 49.68,67.41 44.58,72.51 44.58,105.2 46.06,106.68 51.94,106.68 52.58,107.31 52.58,109.09 51.82,109.86 20.83,109.86 19.2,108.23 SW4.4
N$41
  Top 0.254: RN3.6 U19.6
  Bottom 0.254: U19.6 47.24,48.26 49.78,50.8 49.78,61.95 50.19,62.35 50.19,66.44 55.88,72.13 55.88,97.66 56.77,98.55 56.77,103.5 59.57,106.3 74.55,106.3 76.2,104.65 78.23,104.65 78.74,105.16 SW5.1
N$42
  Top 0.254: RN3.7 U19.7
  Bottom 0.254: U19.7 47.24,45.72 50.29,48.77 50.29,61.74 50.7,62.14 50.7,66.23 56.39,71.92 56.39,97.45 57.28,98.34 57.28,103.29 59.78,105.79 74.33,105.79 75.99,104.14 80.26,104.14 81.28,105.16 SW5.2
N$43
  Top 0.254: RN3.8 U19.8
  Bottom 0.254: U19.8 47.24,43.18 50.8,46.74 50.8,61.53 51.86,62.59 52.68,62.59 53.21,63.12 53.21,68.03 56.9,71.71 56.9,97.24 57.78,98.13 57.78,103.08 59.99,105.28 74.12,105.28 75.78,103.63 82.3,103.63 83.82,105.16 SW5.3
N$44
  Top 0.254: RN3.9 U19.9
  Bottom 0.254: U19.9 47.24,40.64 51.31,44.7 51.31,61.32 51.94,61.95 52.07,62.08 52.89,62.08 53.72,62.91 53.72,67.82 57.4,71.5 57.4,97.03 58.29,97.92 58.29,102.87 60.2,104.78 73.91,104.78 75.56,103.12 84.33,103.12 86.36,105.16 SW5.4
N$45  (via drill 0.5)
  Top 0.254: v32.8,33.21 33.21,32.77 39.03,32.77 39.69,33.42 40.48,33.42 41.64,32.26 51.2,32.26 51.52,32.58 v53.32,32.58 | v34.74,73.46 35.07,73.79 41.89,73.79 v42.22,73.46 45.9,73.46 46.74,74.3 75.18,74.3 v80.52,79.63
  Bottom 0.254: v34.74,73.46 34.04,72.75 34.04,56.48 33.61,56.05 33.61,35.5 32.8,34.69 v32.8,33.21 | v42.22,73.46 42.55,73.14 42.55,71.67 45.72,68.5 U19.1 | U17.15 83.06,96.52 81.66,95.12 81.66,80.77 v80.52,79.63 | U11.1 52.32,22.86 53.75,24.28 53.75,32.16 v53.32,32.58 53.34,32.6 U19.11
N$46  (via drill 0.5)
  Top 0.254: v33.94,33.6 34.27,33.27 38.82,33.27 39.48,33.93 40.69,33.93 41.85,32.77 50.99,32.77 51.64,33.42 53.83,33.42 54.66,32.58 v54.73,32.58 56.27,32.58 57.11,33.42 60.38,33.42 61.03,32.77 68.25,32.77 v68.58,33.09 | v35.88,72.95 36.2,73.28 41.22,73.28 41.87,72.63 42.56,72.63 42.89,72.95 46.11,72.95 46.95,73.79 60.63,73.79 v60.96,73.46 61.29,73.79 75.39,73.79 80.08,78.47 v80.64,78.47
  Bottom 0.254: v35.88,72.95 34.54,71.62 34.54,56.27 34.12,55.84 34.12,35.29 33.94,35.11 v33.94,33.6 | v60.96,73.46 U20.1 | U17.14 83.31,93.98 82.17,92.84 82.17,80.01 80.64,78.49 v80.64,78.47 | U11.2 52.32,20.32 54.25,22.25 54.25,32.1 v54.73,32.58 | v68.58,33.09 U20.11
N$47  (via drill 0.5)
  Top 0.254: v99.06,32.08 98.73,31.75 57.99,31.75 v57.66,32.08 | v83.44,88.9 82.17,87.63 82.17,78.16 80.48,76.47 79.52,76.47 75.81,72.77 62.17,72.77 61.52,72.12 60.4,72.12 60.08,72.44 v58.55,72.44
  Bottom 0.254: U11.11 56.9,15.24 55.27,16.87 55.27,29.68 v57.66,32.08 57.66,33.14 55.24,35.56 55.24,61.72 58.55,65.02 v58.55,72.44 | U22.1 90.81,60.96 89.53,59.69 89.53,40.01 90.17,39.37 94.61,39.37 95.89,38.1 U22.11 v99.06,32.08 | v83.44,88.9 83.44,90.04 84.84,91.44 U17.13
N$50
  Top 0.254: RN2.2 130.18,58.42 127.64,60.96 U5.23 124.46,60.96 115.57,52.07 110.49,52.07 JP4.2
N$52
  Top 0.254: U5.20 127.64,53.34 130.18,50.8 RN2.5 131.44,50.8 133.99,53.34 135.25,54.61 140.34,54.61 140.97,55.24 140.97,62.87 140.34,63.5 U9.5
N$53
  Bottom 0.254: U9.6 140.34,60.96 143,58.29 143,39.62 140.97,37.59 JP2.2
N$54  (via drill 0.5)
  Top 0.254: v79.74,75.51 79.28,75.51 76.03,72.26 62.38,72.26 61.73,71.61 v59.44,71.61 | U11.12 55.24,17.78 53.98,19.05 48.9,19.05 47.62,20.32 U12.13 | v42.62,34.62 42.94,34.29 50.34,34.29 51.31,35.27 v59.05,35.27
  Bottom 0.254: v79.74,75.51 83.19,78.96 83.19,84.71 84.84,86.36 U17.11 | U12.13 43.69,20.32 42.55,21.46 42.55,27.1 43.25,27.81 43.25,33.98 v42.62,34.62 | v59.44,71.61 59.05,71.23 v59.05,35.27
N$55
  Top 0.305: U24.5 C27.1
N$56  (via drill 0.5)
  Top 0.254: v34.09,27.36 34.55,27.36 35.38,26.53 36.5,26.53 37.15,27.18 39.95,27.18 40.6,26.53 42.47,26.53 43.63,27.69 126,27.69 126.65,27.03 127.35,27.03 128.51,28.19 130.05,28.19 130.56,28.7 147.97,28.7 148.62,28.05 149.49,28.05 v150.13,28.7
  Bottom 0.254: U23.12 36.53,40.64 35.69,39.8 35.69,28.96 v34.09,27.36 | v150.13,28.7 150.13,27.67 151.64,26.16 151.64,16.76 150.11,15.24 U24.4
N$57
  Top 0.254: U6.3 112.39,17.78 116.2,21.59 121.92,21.59 132.72,21.59 133.99,22.86 JP1.1
  Bottom 0.254: Y1.8 102.87,13.97 106.68,17.78 U6.3
N$58
  Bottom 0.254: U6.12 120.02,17.78 120.65,17.14 120.65,8.26 120.02,7.62 U6.8
N$59  (via drill 0.5)
  Top 0.254: v125.66,26.85 125.33,27.18 108.28,27.18 v107.95,26.85 | JP4.5 JP4.3 JP4.1
  Bottom 0.254: U7.9 129.29,5.08 128.27,6.1 128.27,24.24 v125.66,26.85 | v107.95,26.85 JP4.5
N$60
  Bottom 0.305: T1.3 R1.1 171.45,35.52 SG1.2
N$61
  Top 0.254: U24.3 150.62,17.78 155.19,13.21 163.07,13.21 163.83,13.97 JP3.1
N$62
  Bottom 0.254: R2.1 165.1,20.95 167.64,18.41 JP3.2
N$63
  Bottom 0.254: U7.11 137.16,10.16 138.43,11.43 JP1.6 JP1.4 JP1.2
N$64  (via drill 0.5)
  Top 0.254: v120.99,76.76 120.47,76.76 120.14,77.09 81.82,77.09 80.57,75.84 80.57,75.17 80.08,74.68 79.16,74.68 76.24,71.75 62.59,71.75 61.61,70.78 59.04,70.78 57.04,72.77 47.83,72.77 v47.47,72.42
  Bottom 0.254: U5.16 125.6,43.18 124.46,44.32 121.92,46.86 121.92,76.29 121.45,76.76 v120.99,76.76 | U4.19 46.74,96.52 45.34,95.12 45.34,74.68 45.34,74.55 v47.47,72.42
N$72
  Top 0.254: U2.9 13.8,78.74 11.57,76.51 BUS.33
N$73
  Top 0.254: BUS.34 5.02,77.72 10.29,77.72 13.84,81.28 U2.8
N$74
  Top 0.254: BUS.35 9.03,79.05 13.8,83.82 U2.7
N$75
  Top 0.254: BUS.36 5.15,80.39 7.87,80.39 10.92,83.44 13.84,86.36 U2.6
N$76
  Top 0.254: U2.5 13.84,88.9 10.41,85.47 10.41,84.37 7.63,81.59 BUS.37
N$77
  Top 0.254: BUS.38 5.15,82.93 7.62,82.93 9.91,85.22 9.91,87.5 13.84,91.44 U2.4
N$78
  Top 0.254: BUS.39 7.42,84.13 9.4,86.11 9.4,89.53 13.84,93.98 U2.3
N$79
  Top 0.254: BUS.40 5.15,85.47 7.37,85.47 8.89,87 8.89,91.57 13.84,96.52 U2.2
N$80
  Top 0.254: BUS.14 5.15,52.45 7.37,52.45 12.95,46.86 12.95,26.29 13.84,25.4 U3.2
N$81
  Top 0.254: BUS.13 7.31,51.11 12.45,45.97 12.45,24.26 13.84,22.86 U3.3
N$82
  Top 0.254: BUS.9 7.31,46.03 11.94,41.4 11.94,22.23 13.84,20.32 U3.4
N$83
  Top 0.254: BUS.8 5.15,44.83 7.24,44.83 11.43,40.64 11.43,20.19 13.84,17.78 U3.5
N$84
  Top 0.254: BUS.7 7.31,43.49 10.92,39.88 10.92,18.16 13.84,15.24 U3.6
N$85
  Top 0.254: BUS.5 7.31,40.95 10.41,37.85 10.41,11.05 13.84,7.62 U3.9
N$86
  Top 0.254: R2.2 168.91,20.95 T1.2
N$88
  Bottom 0.305: R5.2 R4.1 151.13,11.43 152.65,12.95 152.65,18.29 154.69,20.32 U24.7
N$89
  Top 0.305: U24.2 151.13,20.32 153.67,17.78 U24.6
  Bottom 0.254: 154.69,17.78 U24.6
  Bottom 0.305: 154.69,17.78 154.05,17.14 154.05,9.78 154.94,8.89 | C28.1 154.94,8.89 | R5.1 154.94,8.89
N$90  (via drill 0.5)
  Top 0.254: v36.97,72.44 37.29,72.77 41.01,72.77 41.66,72.12 42.77,72.12 43.1,72.44 46.32,72.44 47.16,73.28 59.96,73.28 60.61,72.63 61.31,72.63 61.96,73.28 75.61,73.28 79.63,77.31 v80.14,77.31 | v34.85,34.38 35.45,33.78 38.61,33.78 39.26,34.43 40.9,34.43 42.06,33.27 50.78,33.27 51.43,33.93 54.1,33.93 54.61,33.42 v55.75,33.42 56.39,33.42 56.9,33.93 60.59,33.93 61.24,33.27 67.58,33.27 68.23,33.93 68.93,33.93 70.09,32.77 83.49,32.77 v83.82,33.09
  Bottom 0.254: v36.97,72.44 35.05,70.53 35.05,55.97 34.62,55.54 34.62,34.61 v34.85,34.38 | U21.1 75.56,60.96 74.3,59.69 74.3,40.01 74.93,39.37 79.38,39.37 80.64,38.1 U21.11 v83.82,33.09 | U17.12 84.84,88.9 82.68,86.74 82.68,79.25 80.74,77.31 v80.14,77.31 | U11.3 52.32,17.78 54.76,20.22 54.76,31.43 55.75,32.42 v55.75,33.42
N$92
  Top 0.254: RN2.4 130.18,53.34 127.64,55.88 U5.21 124.46,55.88 115.57,46.99 110.49,46.99 JP4.6

### Text on the board
tPlace: CONFIG | TIMEZONE 1 | TIMEZONE 2 | TIMEZONE 3 | ADDR / ---- / 0x00-03 / 0x04 / 0x08 / 0x09 / 0x0A / 0x0B / 0x0C / 0x10-1F | FUNC / ---- / CTC / WD POKE / BUTTONS/CONFIG / TIMEZONE 1 / TIMEZONE 2 / TIMEZONE 3 / OUTPUTS / RTC | 1 2 3 4 | 1 2 3 4 5 6 7 8 | LSB | POS / --- / 1-2 / / / / / 3 | FUNC / ---- / DIMMING ROW / 00 = NO DIMMING / 01 = ROW 1 / 10 = ROW 2 / 11 = ROW 3 / DIMMING DUTY CYCLE / 0 = 50% / 1 = 25% | LSB | POS / --- / 1-7 / 8 | FUNC / ---- / TIMEZONE # / TIME (OFF), DATE (ON) | PRESCALER SELECTION / POS CTC CH / 1-2 0 / 3-4 1 / 5-6 2 | WATCHDOG RESET / ENABLE | 1-2 555 / 2-3 CTC CH2 | 1-2 ÷ 1 / 3-4 ÷ 2 / 5-6 ÷ 4 / ------- / 256